# EAGLE design Cornverter (EAGLE 9.2.2)

## Sheet 1 of 7: MCU, Crystal and ICSP
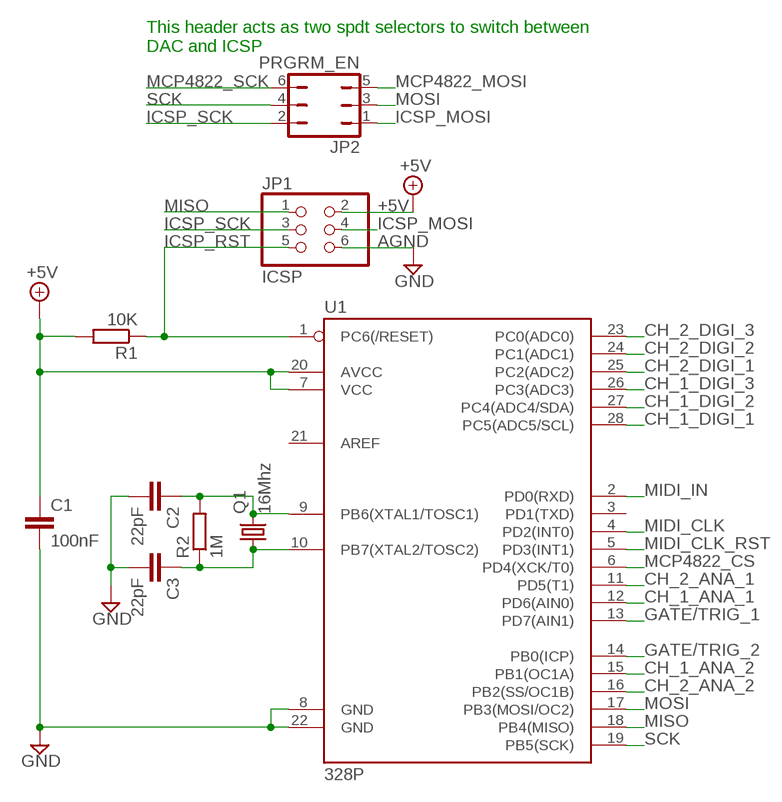
[diagram p0: schematic, sheet 1]

### Parts
C1  100nF  C-EUC1206  [C1206]
C2  22pF  C-EUC1206  [C1206]
C3  22pF  C-EUC1206  [C1206]
JP1  ICSP  PINHD-2X3  [2X03]
JP2  PRGRM_EN  JP3Q  [JP3Q]
Q1  16Mhz  CRYSTALHC49S  [HC49/S]
R1  10K  R-EU_R1206  [R1206]
R2  1M  R-EU_R1206  [R1206]
U1  328P  ATMEGA328P_PDIP  [DIP28]

### Nets
+5V: C1.1 JP1.2 R1.2 U1.7(VCC) U1.20(AVCC) ; also sheet 2,3,4,5,6,7
AGND: C1.2 C2.2 C3.2 JP1.6 U1.8(GND) U1.22(GND) ; supply symbol labelled GND ; also sheet 2,3,4,5,6,7
CH_1_ANA_1: U1.12(PD6(AIN0)) ; also sheet 5
CH_1_ANA_2: U1.15(PB1(OC1A)) ; also sheet 5
CH_1_DIGI_1: U1.28(PC5(ADC5/SCL)) ; also sheet 7
CH_1_DIGI_2: U1.27(PC4(ADC4/SDA)) ; also sheet 7
CH_1_DIGI_3: U1.26(PC3(ADC3)) ; also sheet 7
CH_2_ANA_1: U1.11(PD5(T1)) ; also sheet 5
CH_2_ANA_2: U1.16(PB2(SS/OC1B)) ; also sheet 5
CH_2_DIGI_1: U1.25(PC2(ADC2)) ; also sheet 7
CH_2_DIGI_2: U1.24(PC1(ADC1)) ; also sheet 7
CH_2_DIGI_3: U1.23(PC0(ADC0)) ; also sheet 7
GATE/TRIG_1: U1.13(PD7(AIN1)) ; also sheet 6
GATE/TRIG_2: U1.14(PB0(ICP)) ; also sheet 6
ICSP_MOSI: JP1.4 JP2.1
ICSP_RST: JP1.5 R1.1 U1.1(PC6(/RESET))
ICSP_SCK: JP1.3 JP2.2
MCP4822_CS: U1.6(PD4(XCK/T0)) ; also sheet 4
MCP4822_MOSI: JP2.5 ; also sheet 4
MCP4822_SCK: JP2.6 ; also sheet 4
MIDI_CLK: U1.4(PD2(INT0)) ; also sheet 6
MIDI_CLK_RST: U1.5(PD3(INT1)) ; also sheet 6
MIDI_IN: U1.2(PD0(RXD)) ; also sheet 3
MISO: JP1.1 U1.18(PB4(MISO))
MOSI: JP2.3 U1.17(PB3(MOSI/OC2))
N$3: C3.1 Q1.1 R2.1 U1.10(PB7(XTAL2/TOSC2))
N$4: C2.1 Q1.2 R2.2 U1.9(PB6(XTAL1/TOSC1))
SCK: JP2.4 U1.19(PB5(SCK))
Unconnected: U1.3(PD1(TXD)) U1.21(AREF)

### Notes on the sheet
- This header acts as two spdt selectors to switch between
  DAC and ICSP

## Sheet 2 of 7: Power
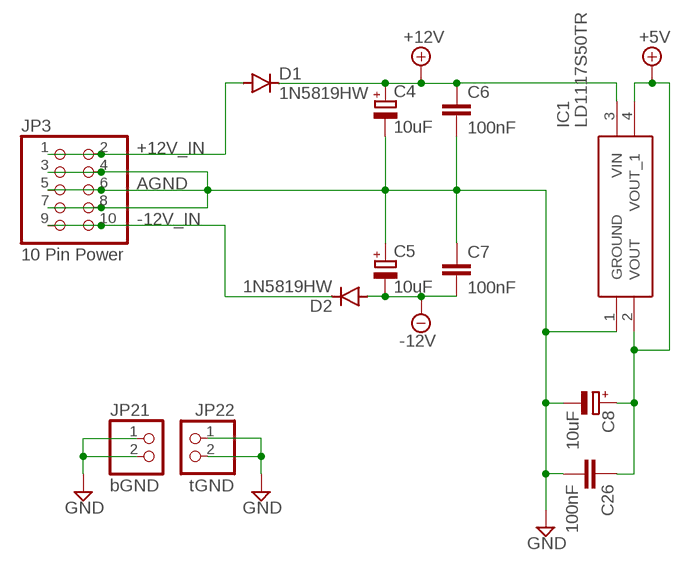
[diagram p1: schematic, sheet 2]

### Parts
C4  10uF  CPOL-EUE2-5  [E2-5]
C5  10uF  CPOL-EUE2-5  [E2-5]
C6  100nF  C-EUC1206  [C1206]
C7  100nF  C-EUC1206  [C1206]
C8  10uF  CPOL-EUE2-5  [E2-5]
C26  100nF  C-EUC1206  [C1206]
D1  1N5819HW  DIODE-SOD123  [SOD123]
D2  1N5819HW  DIODE-SOD123  [SOD123]
IC1  LD1117S50TR  [SOT230P700X190-4N]
JP3  10 Pin Power  PINHD-2X5  [2X05]
JP21  bGND  PINHD-1X2  [1X02]
JP22  tGND  PINHD-1X2  [1X02]

### Nets
+5V: C8.+ C26.1 IC1.2(VOUT) IC1.4(VOUT_1) ; also sheet 1,3,4,5,6,7
+12V: C4.+ C6.1 D1.C IC1.3(VIN) ; also sheet 4,5
+12V_IN: D1.A JP3.1 JP3.2
-12V: C5.- C7.2 D2.A ; also sheet 4,5
-12V_IN: D2.C JP3.9 JP3.10
AGND: C4.- C5.+ C6.2 C7.1 C8.- C26.2 IC1.1(GROUND) JP3.3 JP3.4 JP3.5 JP3.6 JP3.7 JP3.8 JP21.1 JP21.2 JP22.1 JP22.2 ; supply symbol labelled GND ; also sheet 1,3,4,5,6,7

## Sheet 3 of 7: MIDI Input
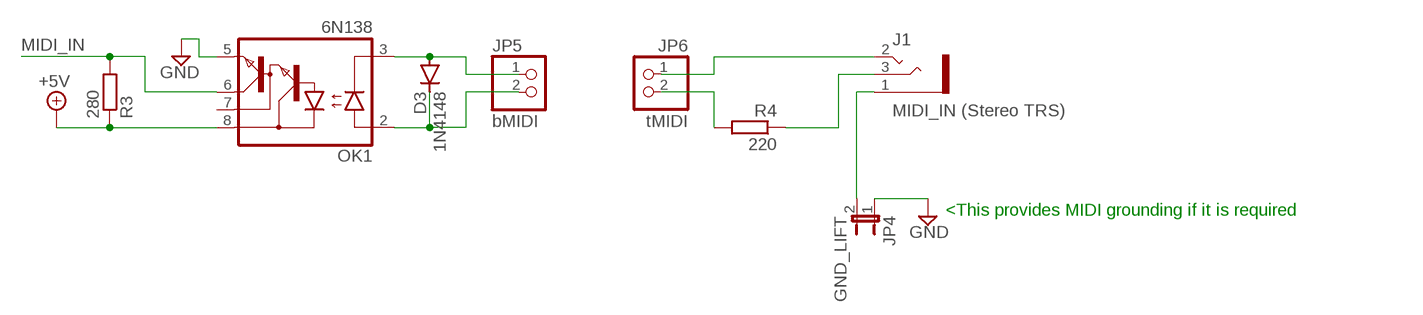
[diagram p2: schematic, sheet 3]

### Parts
D3  1N4148  1N4148DO35-7  [DO35-7]
J1  MIDI_IN (Stereo TRS)  WQP-PJ301M-12-ST_JACK  [WQP-PJ301M-12-ST_JACK]
JP4  GND_LIFT  JP1E  [JP1]
JP5  bMIDI  PINHD-1X2  [1X02]
JP6  tMIDI  PINHD-1X2  [1X02]
OK1  6N138  [DIL08]
R3  280  R-EU_R1206  [R1206]
R4  220  R-EU_R1206  [R1206]

### Nets
+5V: OK1.8(VCC) R3.1 ; also sheet 1,2,4,5,6,7
AGND: JP4.1 OK1.5(GND) ; supply symbol labelled GND ; also sheet 1,2,4,5,6,7
MIDI_IN: OK1.6(VO) R3.2 ; also sheet 1
N$1: J1.1 JP4.2
N$6: J1.3 R4.1
N$13: D3.A JP5.1 OK1.3(C)
N$17: D3.C JP5.2 OK1.2(A)
N$80: JP6.2 R4.2
N$81: J1.2 JP6.1
Unconnected: OK1.7(VB)

### Notes on the sheet
- <This provides MIDI grounding if it is required

## Sheet 4 of 7: V/Oct Outputs
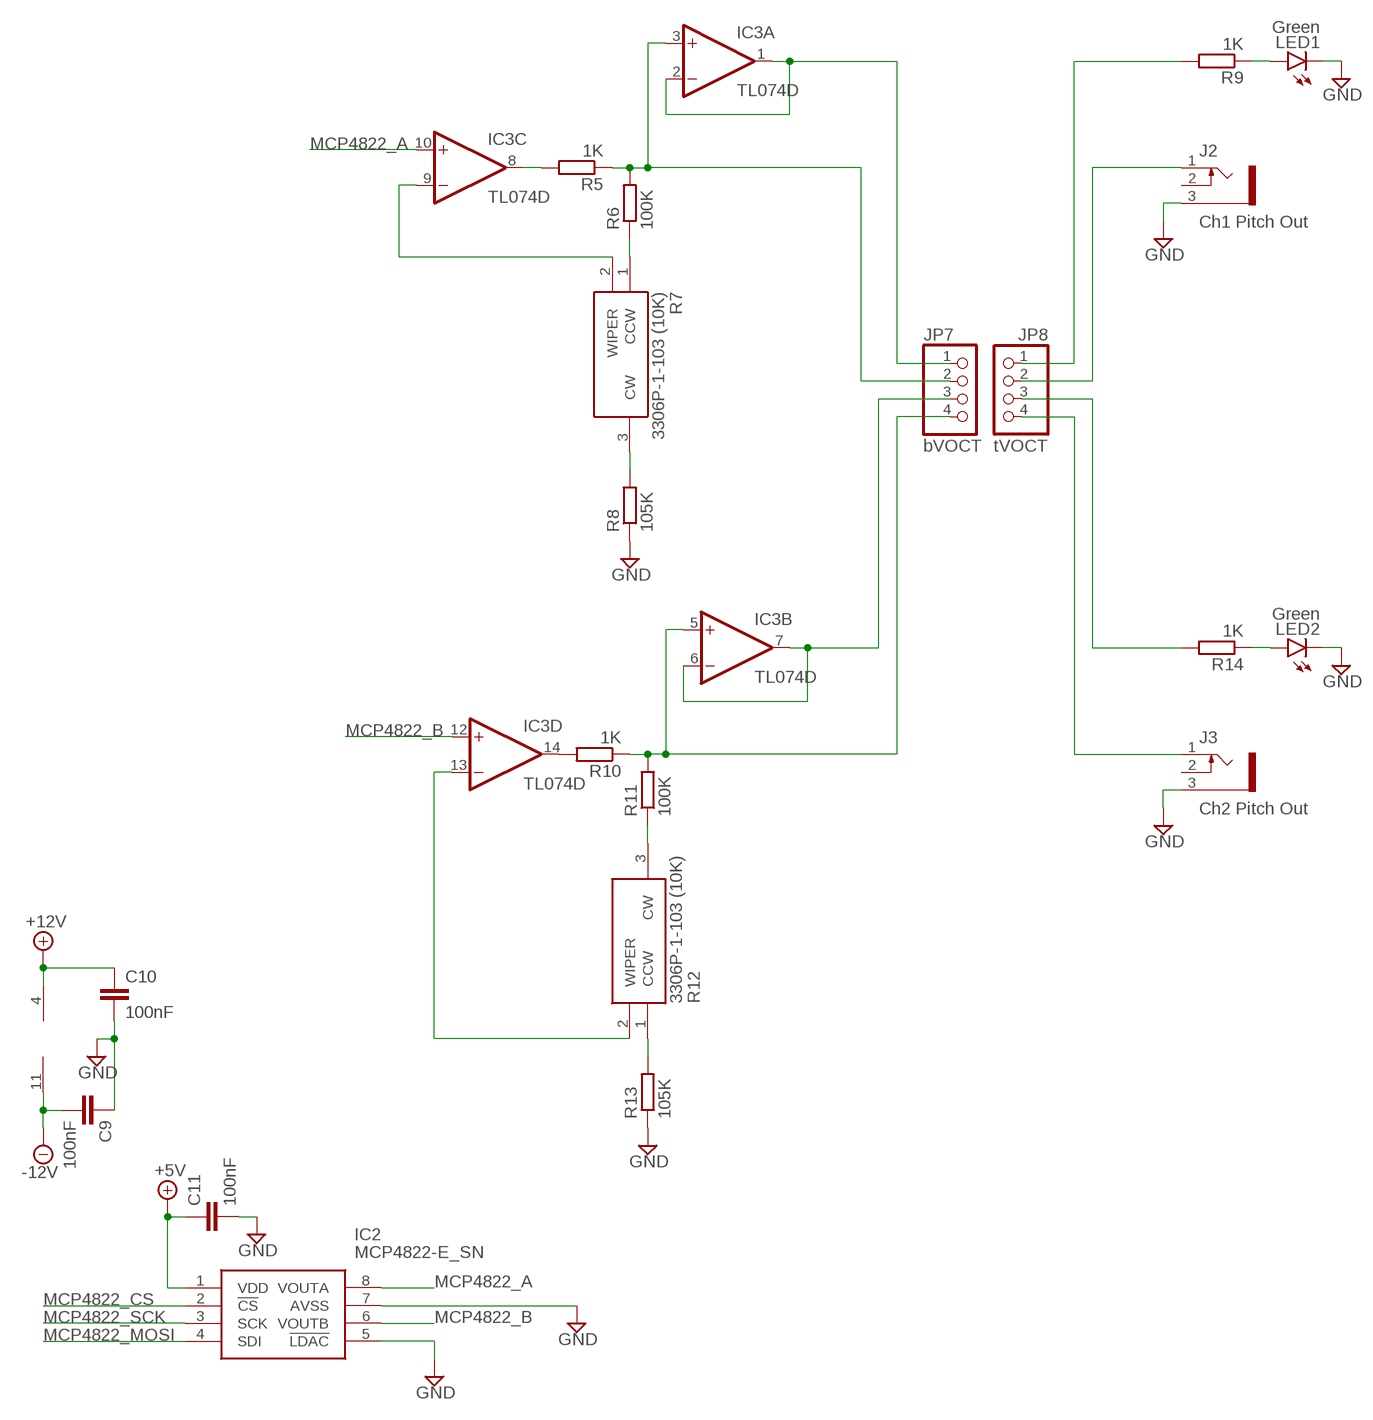
[diagram p3: schematic, sheet 4]

### Parts
C9  100nF  C-EUC1206  [C1206]
C10  100nF  C-EUC1206  [C1206]
C11  100nF  C-EUC1206  [C1206]
IC2  MCP4822-E_SN  [SOIC127P600X175-8N]
IC3  TL074D  [SO14]
J2  Ch1 Pitch Out  WQP-PJ301M-12_JACK  [WQP-PJ301M-12_JACK]
J3  Ch2 Pitch Out  WQP-PJ301M-12_JACK  [WQP-PJ301M-12_JACK]
JP7  bVOCT  PINHD-1X4  [1X04]
JP8  tVOCT  PINHD-1X4  [1X04]
LED1  Green  LED3MM  [LED3MM]
LED2  Green  LED3MM  [LED3MM]
R5  1K  R-EU_R1206  [R1206]
R6  100K  R-EU_R1206  [R1206]
R7  3306P-1-103 (10K)  3306P-1-103  [3306P1103]
R8  105K  R-EU_R1206  [R1206]
R9  1K  R-EU_R1206  [R1206]
R10  1K  R-EU_R1206  [R1206]
R11  100K  R-EU_R1206  [R1206]
R12  3306P-1-103 (10K)  3306P-1-103  [3306P1103]
R13  105K  R-EU_R1206  [R1206]
R14  1K  R-EU_R1206  [R1206]

### Nets
+5V: C11.1 IC2.1(VDD) ; also sheet 1,2,3,5,6,7
+12V: C10.1 IC3.4(P:V+) ; also sheet 2,5
-12V: C9.2 IC3.11(P:V-) ; also sheet 2,5
AGND: C9.1 C10.2 C11.2 IC2.5(!LDAC) IC2.7(AVSS) J2.3 J3.3 LED1.C LED2.C R8.1 R13.1 ; supply symbol labelled GND ; also sheet 1,2,3,5,6,7
MCP4822_A: IC2.8(VOUTA) IC3.10(C:+IN)
MCP4822_B: IC2.6(VOUTB) IC3.12(D:+IN)
MCP4822_CS: IC2.2(!CS) ; also sheet 1
MCP4822_MOSI: IC2.4(SDI) ; also sheet 1
MCP4822_SCK: IC2.3(SCK) ; also sheet 1
N$16: R6.1 R7.1(CCW)
N$19: R7.3(CW) R8.2
N$20: R12.1(CCW) R13.2
N$21: R11.1 R12.3(CW)
N$22: LED1.A R9.1
N$23: IC3.1(A:OUT) IC3.2(A:-IN) JP7.1
N$25: LED2.A R14.1
N$26: IC3.6(B:-IN) IC3.7(B:OUT) JP7.3
N$28: IC3.9(C:-IN) R7.2(WIPER)
N$29: IC3.3(A:+IN) JP7.2 R5.1 R6.2
N$33: IC3.13(D:-IN) R12.2(WIPER)
N$37: IC3.5(B:+IN) JP7.4 R10.1 R11.2
N$74: IC3.14(D:OUT) R10.2
N$75: IC3.8(C:OUT) R5.2
N$79: JP8.1 R9.2
N$84: J2.1 JP8.2
N$85: JP8.3 R14.2
N$86: J3.1 JP8.4
Unconnected: J2.2 J3.2

## Sheet 5 of 7: PWM Outputs
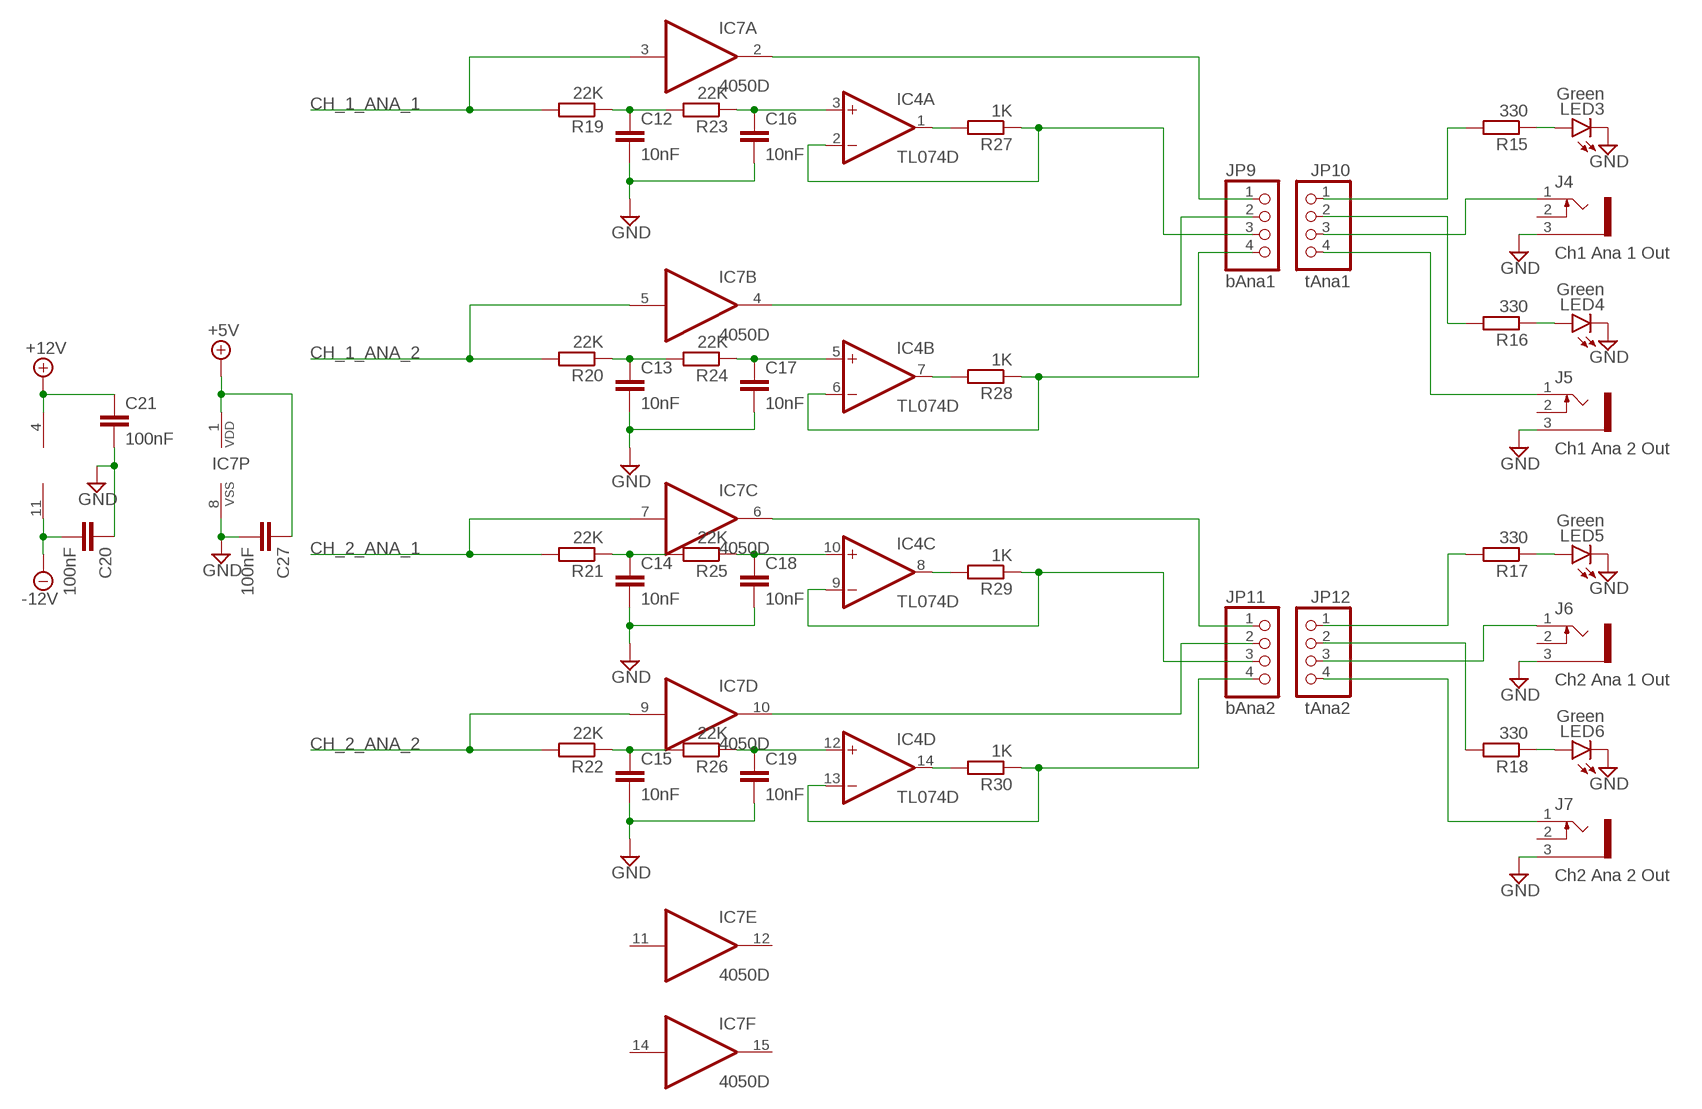
[diagram p4: schematic, sheet 5]

### Parts
C12  10nF  C-EUC1206  [C1206]
C13  10nF  C-EUC1206  [C1206]
C14  10nF  C-EUC1206  [C1206]
C15  10nF  C-EUC1206  [C1206]
C16  10nF  C-EUC1206  [C1206]
C17  10nF  C-EUC1206  [C1206]
C18  10nF  C-EUC1206  [C1206]
C19  10nF  C-EUC1206  [C1206]
C20  100nF  C-EUC1206  [C1206]
C21  100nF  C-EUC1206  [C1206]
C27  100nF  C-EUC1206  [C1206]
IC4  TL074D  [SO14]
IC7  4050D  [SO16]
J4  Ch1 Ana 1 Out  WQP-PJ301M-12_JACK  [WQP-PJ301M-12_JACK]
J5  Ch1 Ana 2 Out  WQP-PJ301M-12_JACK  [WQP-PJ301M-12_JACK]
J6  Ch2 Ana 1 Out  WQP-PJ301M-12_JACK  [WQP-PJ301M-12_JACK]
J7  Ch2 Ana 2 Out  WQP-PJ301M-12_JACK  [WQP-PJ301M-12_JACK]
JP9  bAna1  PINHD-1X4  [1X04]
JP10  tAna1  PINHD-1X4  [1X04]
JP11  bAna2  PINHD-1X4  [1X04]
JP12  tAna2  PINHD-1X4  [1X04]
LED3  Green  LED3MM  [LED3MM]
LED4  Green  LED3MM  [LED3MM]
LED5  Green  LED3MM  [LED3MM]
LED6  Green  LED3MM  [LED3MM]
R15  330  R-EU_R1206  [R1206]
R16  330  R-EU_R1206  [R1206]
R17  330  R-EU_R1206  [R1206]
R18  330  R-EU_R1206  [R1206]
R19  22K  R-EU_R1206  [R1206]
R20  22K  R-EU_R1206  [R1206]
R21  22K  R-EU_R1206  [R1206]
R22  22K  R-EU_R1206  [R1206]
R23  22K  R-EU_R1206  [R1206]
R24  22K  R-EU_R1206  [R1206]
R25  22K  R-EU_R1206  [R1206]
R26  22K  R-EU_R1206  [R1206]
R27  1K  R-EU_R1206  [R1206]
R28  1K  R-EU_R1206  [R1206]
R29  1K  R-EU_R1206  [R1206]
R30  1K  R-EU_R1206  [R1206]

### Nets
+5V: C27.1 IC7.1(P:VDD) ; also sheet 1,2,3,4,6,7
+12V: C21.1 IC4.4(P:V+) ; also sheet 2,4
-12V: C20.2 IC4.11(P:V-) ; also sheet 2,4
AGND: C12.2 C13.2 C14.2 C15.2 C16.2 C17.2 C18.2 C19.2 C20.1 C21.2 C27.2 IC7.8(P:VSS) J4.3 J5.3 J6.3 J7.3 LED3.C LED4.C LED5.C LED6.C ; supply symbol labelled GND ; also sheet 1,2,3,4,6,7
CH_1_ANA_1: IC7.3(A:I) R19.2 ; also sheet 1
CH_1_ANA_2: IC7.5(B:I) R20.2 ; also sheet 1
CH_2_ANA_1: IC7.7(C:I) R21.2 ; also sheet 1
CH_2_ANA_2: IC7.9(D:I) R22.2 ; also sheet 1
N$41: C13.1 R20.1 R24.2
N$50: LED4.A R16.1
N$56: IC4.6(B:-IN) JP9.4 R28.1
N$57: C12.1 R19.1 R23.2
N$59: LED3.A R15.1
N$60: IC4.7(B:OUT) R28.2
N$61: C17.1 IC4.5(B:+IN) R24.1
N$62: IC4.1(A:OUT) R27.2
N$63: C14.1 R21.1 R25.2
N$64: LED5.A R17.1
N$65: IC4.9(C:-IN) JP11.3 R29.1
N$67: IC4.8(C:OUT) R29.2
N$69: C16.1 IC4.3(A:+IN) R23.1
N$70: C18.1 IC4.10(C:+IN) R25.1
N$71: C15.1 R22.1 R26.2
N$72: LED6.A R18.1
N$73: IC4.13(D:-IN) JP11.4 R30.1
N$76: IC4.14(D:OUT) R30.2
N$77: IC4.2(A:-IN) JP9.3 R27.1
N$78: C19.1 IC4.12(D:+IN) R26.1
N$87: JP10.1 R15.2
N$88: J4.1 JP10.3
N$90: J5.1 JP10.4
N$91: JP12.1 R17.2
N$92: JP12.2 R18.2
N$93: J6.1 JP12.3
N$94: J7.1 JP12.4
N$115: JP10.2 R16.2
N$119: IC7.2(A:O) JP9.1
N$120: IC7.4(B:O) JP9.2
N$121: IC7.6(C:O) JP11.1
N$122: IC7.10(D:O) JP11.2
Unconnected: IC7.11(E:I) IC7.12(E:O) IC7.14(F:I) IC7.15(F:O) J4.2 J5.2 J6.2 J7.2

## Sheet 6 of 7: Gate/Trig/Clock
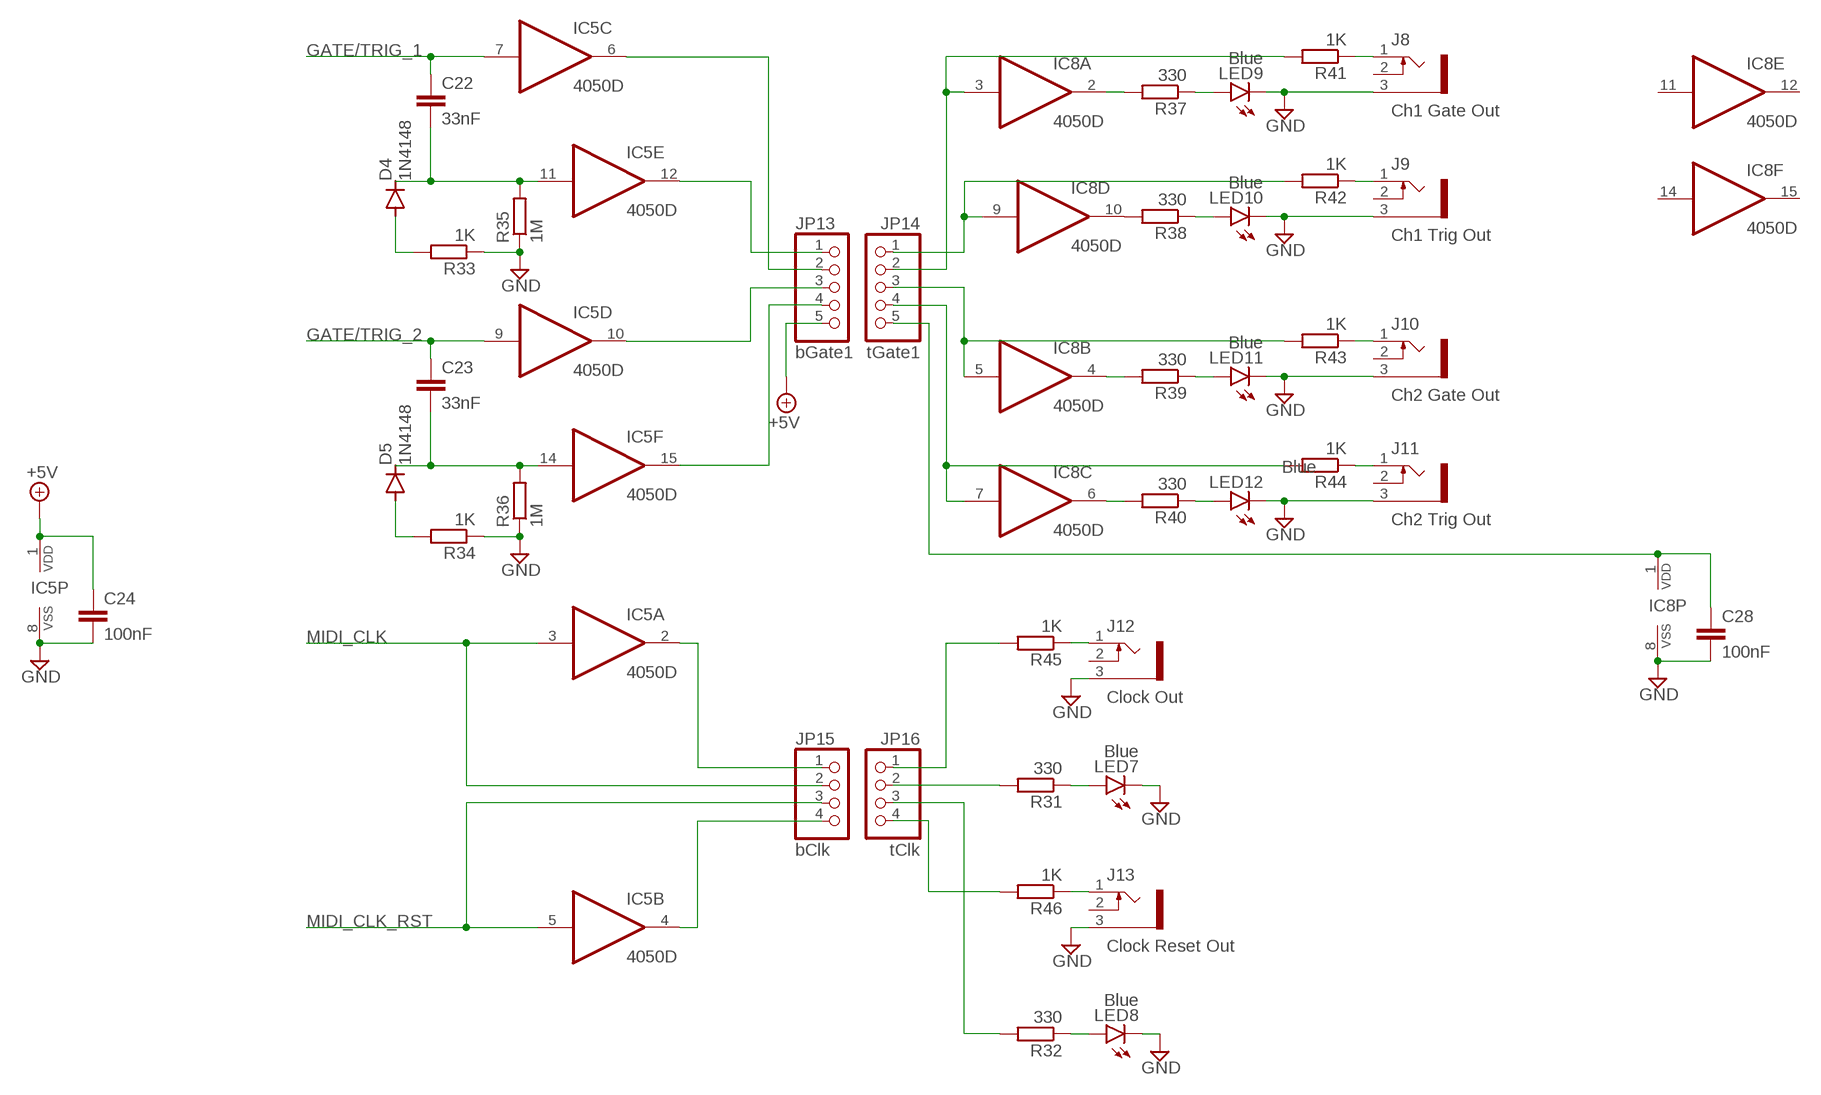
[diagram p5: schematic, sheet 6]

### Parts
C22  33nF  C-EUC1206  [C1206]
C23  33nF  C-EUC1206  [C1206]
C24  100nF  C-EUC1206  [C1206]
C28  100nF  C-EUC1206  [C1206]
D4  1N4148  1N4148DO35-7  [DO35-7]
D5  1N4148  1N4148DO35-7  [DO35-7]
IC5  4050D  [SO16]
IC8  4050D  [SO16]
J8  Ch1 Gate Out  WQP-PJ301M-12_JACK  [WQP-PJ301M-12_JACK]
J9  Ch1 Trig Out  WQP-PJ301M-12_JACK  [WQP-PJ301M-12_JACK]
J10  Ch2 Gate Out  WQP-PJ301M-12_JACK  [WQP-PJ301M-12_JACK]
J11  Ch2 Trig Out  WQP-PJ301M-12_JACK  [WQP-PJ301M-12_JACK]
J12  Clock Out  WQP-PJ301M-12_JACK  [WQP-PJ301M-12_JACK]
J13  Clock Reset Out  WQP-PJ301M-12_JACK  [WQP-PJ301M-12_JACK]
JP13  bGate1  PINHD-1X5  [1X05]
JP14  tGate1  PINHD-1X5  [1X05]
JP15  bClk  PINHD-1X4  [1X04]
JP16  tClk  PINHD-1X4  [1X04]
LED7  Blue  LED3MM  [LED3MM]
LED8  Blue  LED3MM  [LED3MM]
LED9  Blue  LED3MM  [LED3MM]
LED10  Blue  LED3MM  [LED3MM]
LED11  Blue  LED3MM  [LED3MM]
LED12  Blue  LED3MM  [LED3MM]
R31  330  R-EU_R1206  [R1206]
R32  330  R-EU_R1206  [R1206]
R33  1K  R-EU_R1206  [R1206]
R34  1K  R-EU_R1206  [R1206]
R35  1M  R-EU_R1206  [R1206]
R36  1M  R-EU_R1206  [R1206]
R37  330  R-EU_R1206  [R1206]
R38  330  R-EU_R1206  [R1206]
R39  330  R-EU_R1206  [R1206]
R40  330  R-EU_R1206  [R1206]
R41  1K  R-EU_R1206  [R1206]
R42  1K  R-EU_R1206  [R1206]
R43  1K  R-EU_R1206  [R1206]
R44  1K  R-EU_R1206  [R1206]
R45  1K  R-EU_R1206  [R1206]
R46  1K  R-EU_R1206  [R1206]

### Nets
+5V: C24.1 IC5.1(P:VDD) JP13.5 ; also sheet 1,2,3,4,5,7
AGND: C24.2 C28.2 IC5.8(P:VSS) IC8.8(P:VSS) J8.3 J9.3 J10.3 J11.3 J12.3 J13.3 LED7.C LED8.C LED9.C LED10.C LED11.C LED12.C R33.1 R34.1 R35.1 R36.1 ; supply symbol labelled GND ; also sheet 1,2,3,4,5,7
GATE/TRIG_1: C22.1 IC5.7(C:I) ; also sheet 1
GATE/TRIG_2: C23.1 IC5.9(D:I) ; also sheet 1
MIDI_CLK: IC5.3(A:I) JP15.2 ; also sheet 1
MIDI_CLK_RST: IC5.5(B:I) JP15.3 ; also sheet 1
N$24: C22.2 D4.C IC5.11(E:I) R35.2
N$27: D4.A R33.2
N$30: IC8.7(C:I) JP14.4 R44.2
N$31: LED12.A R40.1
N$32: LED11.A R39.1
N$34: IC8.5(B:I) JP14.3 R43.2
N$35: J11.1 R44.1
N$36: J10.1 R43.1
N$38: C23.2 D5.C IC5.14(F:I) R36.2
N$39: D5.A R34.2
N$40: IC8.9(D:I) JP14.1 R42.2
N$42: LED10.A R38.1
N$43: LED9.A R37.1
N$44: IC8.3(A:I) JP14.2 R41.2
N$45: LED7.A R31.1
N$46: J12.1 R45.1
N$47: IC5.2(A:O) JP15.1
N$48: J13.1 R46.1
N$49: IC5.4(B:O) JP15.4
N$51: LED8.A R32.1
N$82: J9.1 R42.1
N$83: J8.1 R41.1
N$89: IC8.2(A:O) R37.2
N$95: IC5.6(C:O) JP13.2
N$96: IC5.12(E:O) JP13.1
N$97: IC5.15(F:O) JP13.4
N$98: IC5.10(D:O) JP13.3
N$100: JP16.1 R45.2
N$101: JP16.2 R31.2
N$102: JP16.4 R46.2
N$103: JP16.3 R32.2
N$116: IC8.10(D:O) R38.2
N$117: IC8.4(B:O) R39.2
N$118: IC8.6(C:O) R40.2
TOP+5V: C28.1 IC8.1(P:VDD) JP14.5
Unconnected: IC8.11(E:I) IC8.12(E:O) IC8.14(F:I) IC8.15(F:O) J8.2 J9.2 J10.2 J11.2 J12.2 J13.2

## Sheet 7 of 7: General Digital Outs
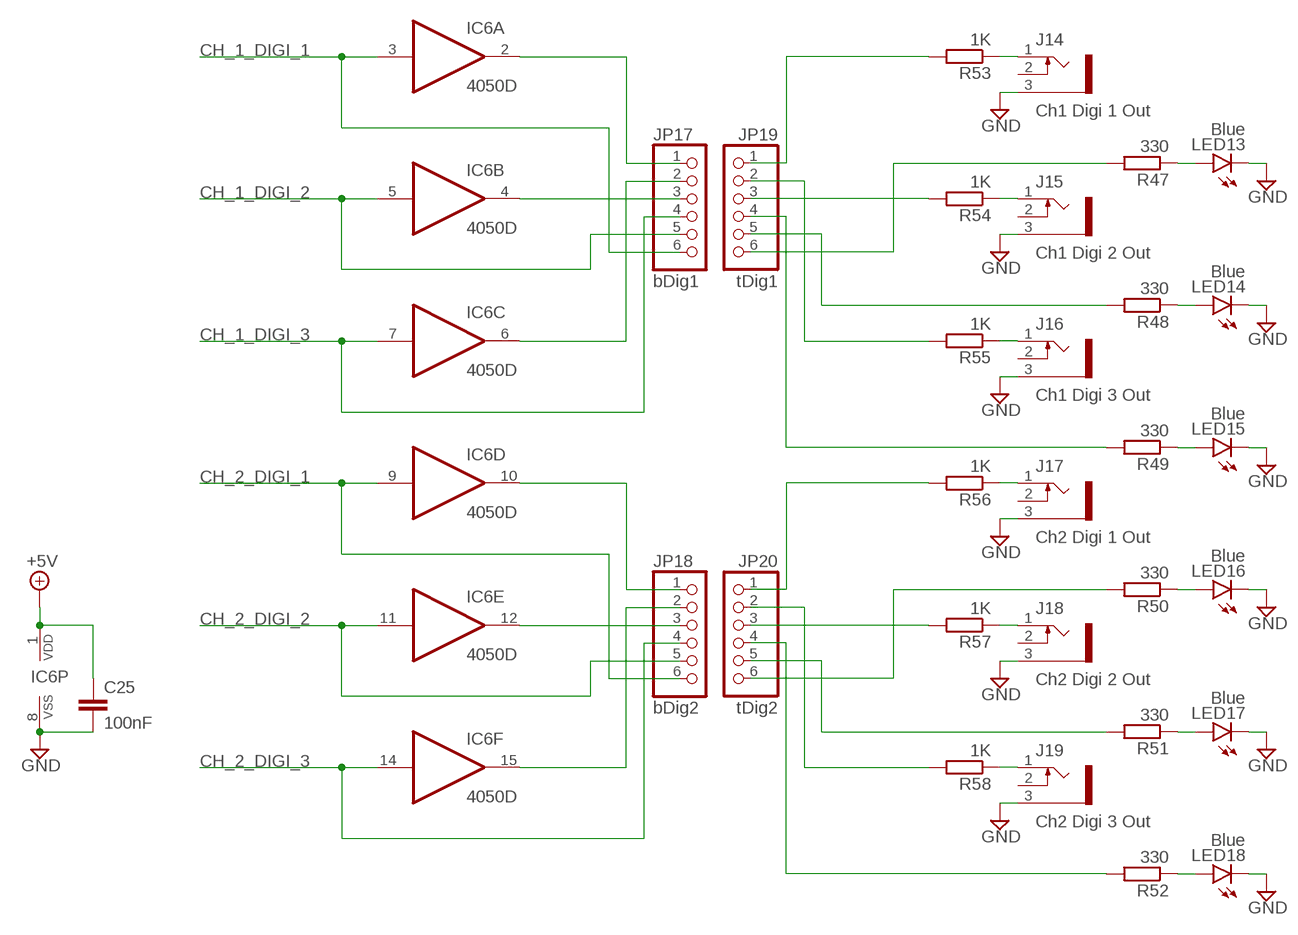
[diagram p6: schematic, sheet 7]

### Parts
C25  100nF  C-EUC1206  [C1206]
IC6  4050D  [SO16]
J14  Ch1 Digi 1 Out  WQP-PJ301M-12_JACK  [WQP-PJ301M-12_JACK]
J15  Ch1 Digi 2 Out  WQP-PJ301M-12_JACK  [WQP-PJ301M-12_JACK]
J16  Ch1 Digi 3 Out  WQP-PJ301M-12_JACK  [WQP-PJ301M-12_JACK]
J17  Ch2 Digi 1 Out  WQP-PJ301M-12_JACK  [WQP-PJ301M-12_JACK]
J18  Ch2 Digi 2 Out  WQP-PJ301M-12_JACK  [WQP-PJ301M-12_JACK]
J19  Ch2 Digi 3 Out  WQP-PJ301M-12_JACK  [WQP-PJ301M-12_JACK]
JP17  bDig1  PINHD-1X6  [1X06]
JP18  bDig2  PINHD-1X6  [1X06]
JP19  tDig1  PINHD-1X6  [1X06]
JP20  tDig2  PINHD-1X6  [1X06]
LED13  Blue  LED3MM  [LED3MM]
LED14  Blue  LED3MM  [LED3MM]
LED15  Blue  LED3MM  [LED3MM]
LED16  Blue  LED3MM  [LED3MM]
LED17  Blue  LED3MM  [LED3MM]
LED18  Blue  LED3MM  [LED3MM]
R47  330  R-EU_R1206  [R1206]
R48  330  R-EU_R1206  [R1206]
R49  330  R-EU_R1206  [R1206]
R50  330  R-EU_R1206  [R1206]
R51  330  R-EU_R1206  [R1206]
R52  330  R-EU_R1206  [R1206]
R53  1K  R-EU_R1206  [R1206]
R54  1K  R-EU_R1206  [R1206]
R55  1K  R-EU_R1206  [R1206]
R56  1K  R-EU_R1206  [R1206]
R57  1K  R-EU_R1206  [R1206]
R58  1K  R-EU_R1206  [R1206]

### Nets
+5V: C25.1 IC6.1(P:VDD) ; also sheet 1,2,3,4,5,6
AGND: C25.2 IC6.8(P:VSS) J14.3 J15.3 J16.3 J17.3 J18.3 J19.3 LED13.C LED14.C LED15.C LED16.C LED17.C LED18.C ; supply symbol labelled GND ; also sheet 1,2,3,4,5,6
CH_1_DIGI_1: IC6.3(A:I) JP17.6 ; also sheet 1
CH_1_DIGI_2: IC6.5(B:I) JP17.5 ; also sheet 1
CH_1_DIGI_3: IC6.7(C:I) JP17.4 ; also sheet 1
CH_2_DIGI_1: IC6.9(D:I) JP18.6 ; also sheet 1
CH_2_DIGI_2: IC6.11(E:I) JP18.5 ; also sheet 1
CH_2_DIGI_3: IC6.14(F:I) JP18.4 ; also sheet 1
N$2: LED15.A R49.1
N$5: J16.1 R55.1
N$7: JP19.1 R53.2
N$8: J17.1 R56.1
N$9: JP19.6 R47.2
N$10: LED16.A R50.1
N$11: LED17.A R51.1
N$12: J18.1 R57.1
N$14: JP19.3 R54.2
N$15: J19.1 R58.1
N$18: JP19.4 R49.2
N$52: LED13.A R47.1
N$53: J14.1 R53.1
N$54: JP19.2 R55.2
N$55: J15.1 R54.1
N$58: JP19.5 R48.2
N$66: LED14.A R48.1
N$68: LED18.A R52.1
N$99: JP20.1 R56.2
N$104: JP20.6 R50.2
N$105: JP20.2 R58.2
N$106: JP20.5 R51.2
N$107: JP20.3 R57.2
N$108: JP20.4 R52.2
N$109: IC6.2(A:O) JP17.1
N$110: IC6.6(C:O) JP17.2
N$111: IC6.10(D:O) JP18.1
N$112: IC6.15(F:O) JP18.2
N$113: IC6.12(E:O) JP18.3
N$114: IC6.4(B:O) JP17.3
Unconnected: J14.2 J15.2 J16.2 J17.2 J18.2 J19.2

## Library data of the parts
C1-C3 C6 C7 C9-C28 = rcl:C-EU: CAPACITOR, European symbol; SPICEPREFIX: C
C4 C5 C8 = rcl:CPOL-EU: POLARIZED CAPACITOR, European symbol; SPICEPREFIX: C
D1 D2 = diode:DIODE-: DIODE
D3-D5 = diode:1N4148: DIODE high speed (Philips)
IC1 = SamacSys_Parts:LD1117S50TR: LD1117S50TR, Low Dropout Voltage Regulator, 1.3A, 5 V 1%, 4-Pin SOT-223 Source: Datasheet <https://componentsearchengine.com/Datasheets/1/LD1117S50TR.pdf>; DESCRIPTION: LD1117S50TR, Low Dropout Voltage Regulator, 1.3A, 5 V 1%, 4-Pin SOT-223; HEIGHT: 1.9mm; MANUFACTURER_NAME: STMicroelectronics; MANUFACTURER_PART_NUMBER: LD1117S50TR; MOUSER_PART_NUMBER: 511-LD1117S50
IC2 = SamacSys_Parts:MCP4822-E_SN: D/A Converter 12-Bit 2ch SPI SOIC8 Source: Datasheet <https://componentsearchengine.com/Datasheets/1/MCP4822-E_SN.pdf>; DESCRIPTION: D/A Converter 12-Bit 2ch SPI SOIC8; HEIGHT: 1.75mm; MANUFACTURER_NAME: Microchip; MANUFACTURER_PART_NUMBER: MCP4822-E/SN; MOUSER_PART_NUMBER: 579-MCP4822-E/SN
IC3 IC4 = Improved parts:TL074: OP AMP
IC5-IC8 = 40xx:4050: Hex non-inverting BUFFER
J1 = thonkiconn:WQP-PJ301M-12-ST_JACK: Thonkiconn stereo jack
J2-J19 = thonkiconn:WQP-PJ301M-12_JACK: Thonkiconn mono jack
JP1 = pinhead:PINHD-2X3: PIN HEADER
JP2 = jumper:JP3Q: JUMPER
JP3 = pinhead:PINHD-2X5: PIN HEADER
JP4 = jumper:JP1E: JUMPER
JP5 JP6 JP21 JP22 = pinhead:PINHD-1X2: PIN HEADER
JP7-JP12 JP15 JP16 = pinhead:PINHD-1X4: PIN HEADER
JP13 JP14 = pinhead:PINHD-1X5: PIN HEADER
JP17-JP20 = pinhead:PINHD-1X6: PIN HEADER
LED1-LED18 = Improved parts:LED3MM: 3MM LED with clearer silkscreen than stock
OK1 = optocoupler:6N138: MOTOROLA OPTO COUPLER; MF: VISHAY/TELEFUNKEN; MPN: 6N138; OC_FARNELL: 9860150; OC_NEWARK: 35K5294; SPICEPREFIX: X
Q1 = crystal:CRYSTAL: CRYSTAL; OC_FARNELL: 1667008; OC_NEWARK: unknown
R1 = resistor:R-EU_: RESISTOR, European symbol
R2-R6 R8-R11 R13-R58 = rcl:R-EU_: RESISTOR, European symbol; SPICEPREFIX: R
R7 R12 = SamacSys_Parts:3306P-1-103: 3306P 1-turn cermet trimmer,10K 300mW Bourns 3306P Series Through Hole Cermet Trimmer Resistor with Pin Terminations, 10k 25% 1/5W 250ppm/C Top Adjust Source: Datasheet <https://componentsearchengine.com/Datasheets/1/3306P-1-103.pdf>; DESCRIPTION: 3306P 1-turn cermet trimmer,10K 300mW Bourns 3306P Series Through Hole Cermet Trimmer Resistor with Pin Terminations, 10k 25% 1/5W 250ppm/C Top Adjust; HEIGHT: 8mm; MANUFACTURER_NAME: Bourns; MANUFACTURER_PART_NUMBER: 3306P-1-103; MOUSER_PART_NUMBER: 652-3306P-1-103
U1 = SparkFun-IC-Microcontroller:ATMEGA328P_PDIP: Atmel 328P Through hole ATMEGA328P uC used in the Arduino 32kb flash, 1k EEPROM, 2k SRAM Datasheet <http://www.sparkfun.com/datasheets/Components/SMD/ATMega328.pdf> SparkFun Products Storefront component: AVR 28 Pin 20MHz 32K 6A/D - ATMega328P <https://www.sparkfun.com/products/9061> (COM-09061) SparkFun Simon Says - Through-Hole Soldering Kit <https://www.sparkfun.com/products/10547> (KIT-10547) SparkFun Learn to Solder - Simon Says <https://www.sparkfun.com/products/13708> (KIT-13708) SparkFun BigTime Watch Kit <https://www.sparkfun.com/products/11734> (KIT-11734) SparkFun ClockIt <https://www.sparkfun.com/products/10930> (KIT-10930) SparkFun Serial Enabled LCD Kit <https://www.sparkfun.com/products/10097> (LCD-10097) SparkFun Simon Tilts - Through Hole Soldering Kit <https://www.sparkfun.com/products/12634> (KIT-12634) SparkFun Frequency Counter Kit <https://www.sparkfun.com/products/10140> (KIT-10140) FabFM Radio Kit <https://www.sparkfun.com/products/11043> (KIT-11043) SparkFun Binary Blaster Kit <https://www.sparkfun.com/products/12037> (KIT-12037) SparkFun Metro-Gnome <https://www.sparkfun.com/products/9236> (KIT-09236) ATmega328 with Arduino Optiboot (Uno) <https://www.sparkfun.com/products/10524> (DEV-10524); PROD_ID: IC-09136

## Board
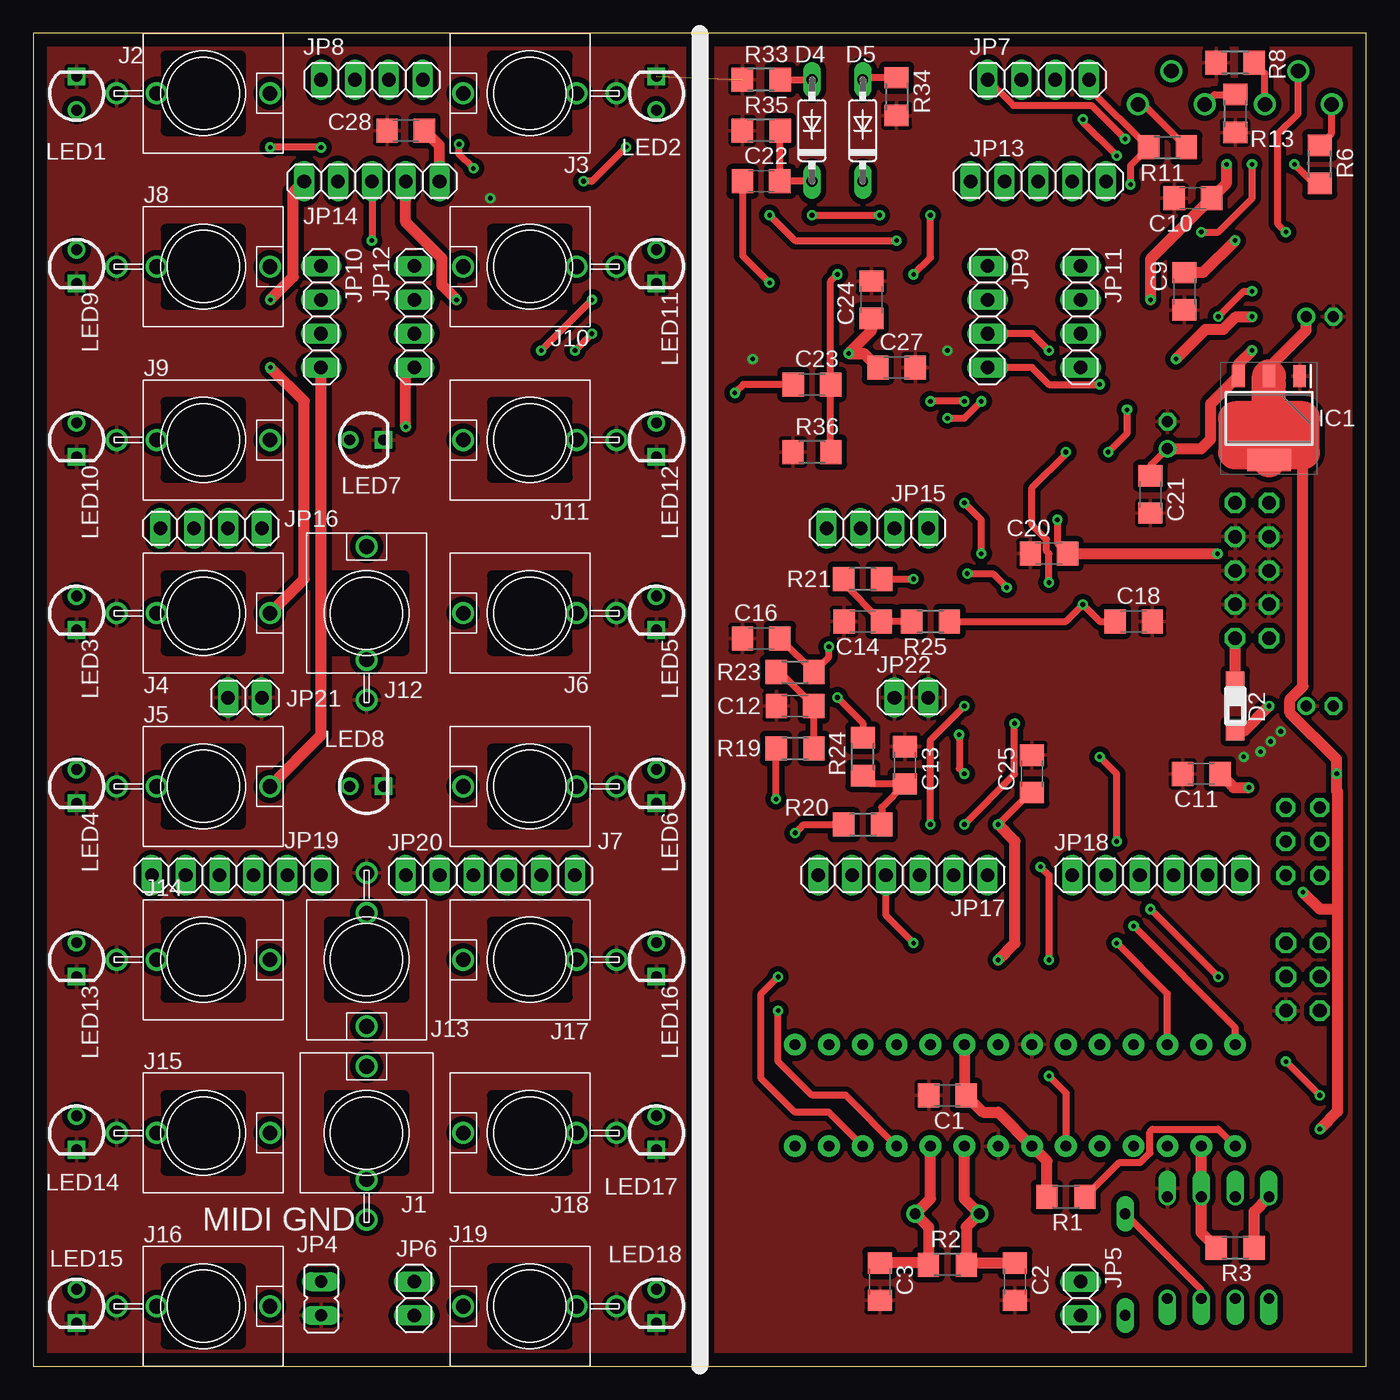
[diagram p7: board, top side]
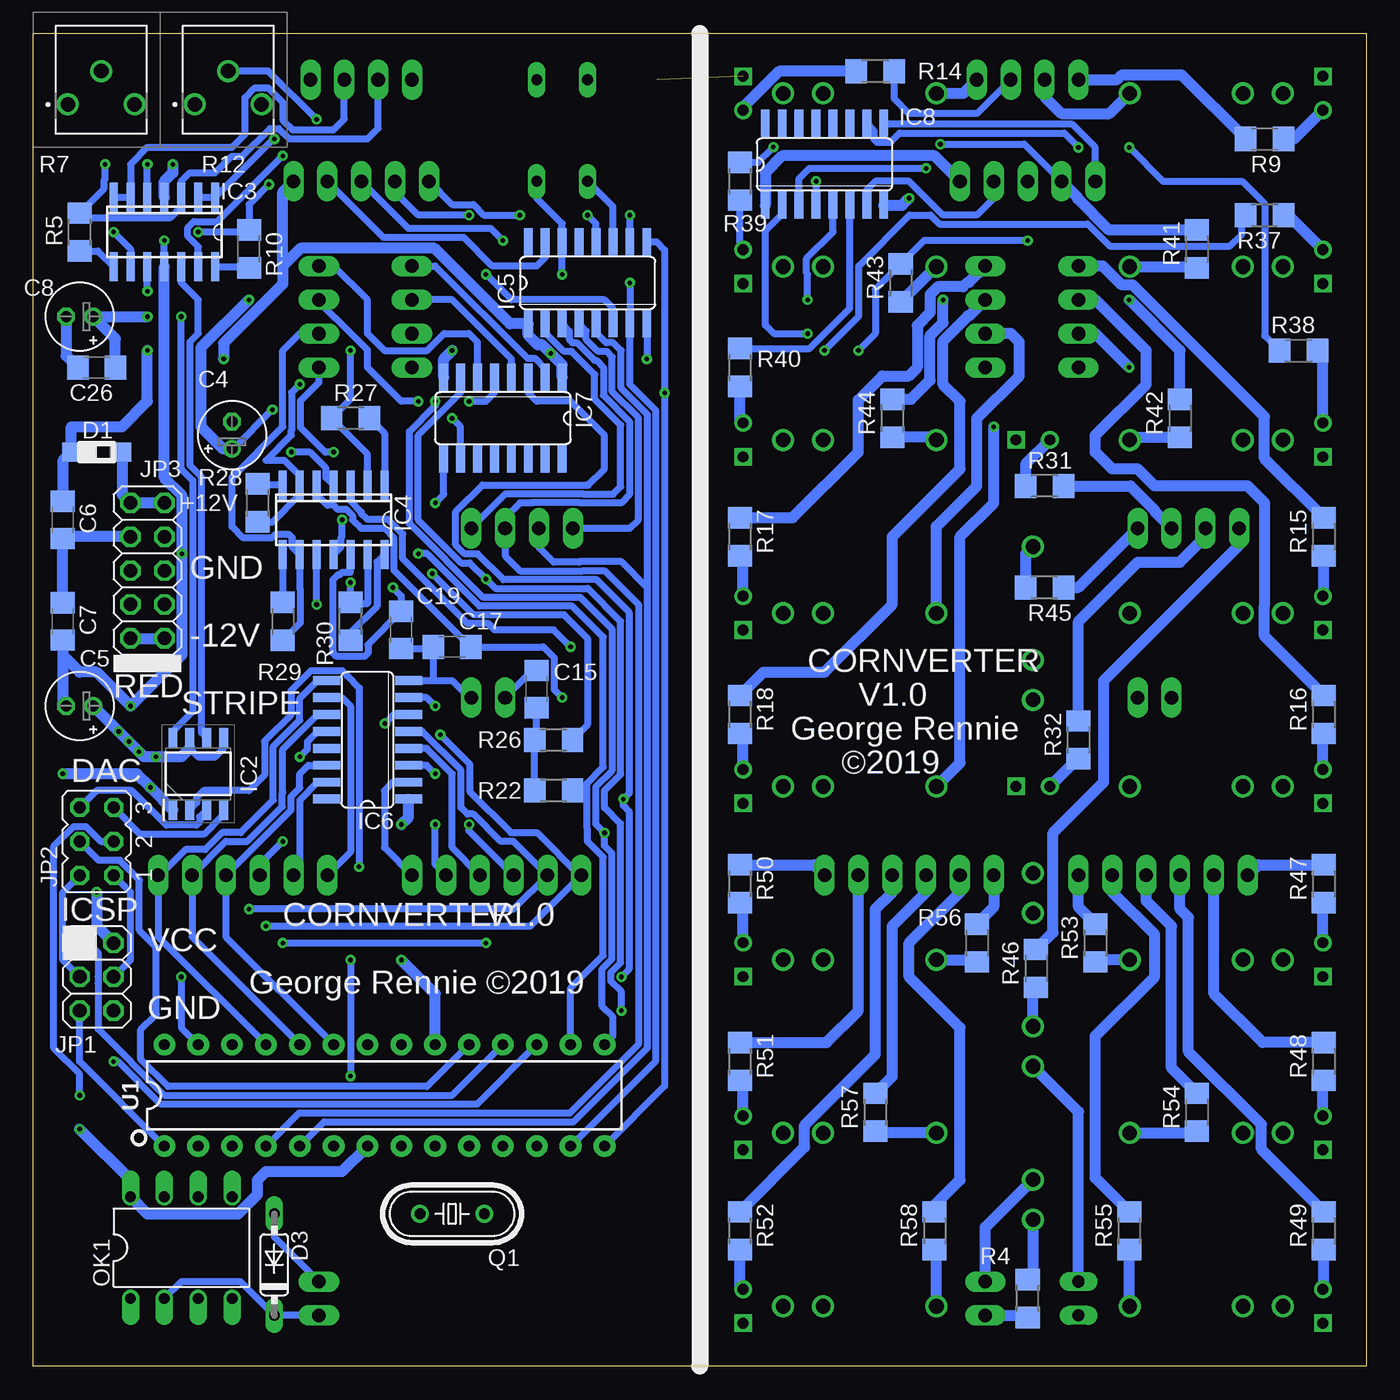
[diagram p8: board, bottom side, seen from below]

Size 100 x 100 mm. Coordinates in mm from the lower left corner, seen from the top.
Outline: 0,0 100,0 100,100 0,100 0,0
Copper layers (1*16): Top 0.035mm / dielectric 1.5mm / Bottom 0.035mm
Design rules "default *": minimum track width 6mil, minimum drill 0.35mm, track to track 6mil, track to pad 6mil, pad to pad 6mil, via to via 6mil, smd to smd 6mil, copper to edge 40mil, drill to drill 6mil, minimum pad ring 10mil, minimum via ring 8mil, stop-mask expansion 4mil, vias tented up to drill 0mil, thermal gap 10mil
tRestrict: 1 lines
bRestrict: 1 lines

### Footprints (pad centres in the part's own frame; a part is rotated, then mirrored left to right if it is on the bottom)
C1206 = smd 1.6 x 1.8: 1 -1.4,0; 2 1.4,0
E2-5 = drill 0.813 pad 1.27: + -1.016,0 | drill 0.813 pad 1.27 octagon: - 1.016,0
SOD123 = smd 1.4 x 1.4: A 1.9,0; C -1.9,0
DO35-7 = drill 0.813 long: A 3.81,0; C -3.81,0
SOT230P700X190-4N = smd 1.65 x 0.95: 1 -3.15,2.3; 2 -3.15,0; 3 -3.15,-2.3 | smd 1.65 x 3.25: 4 3.15,0
SOIC127P600X175-8N = smd 1.5 x 0.65: 1 -2.7,1.905; 2 -2.7,0.635; 3 -2.7,-0.635; 4 -2.7,-1.905; 5 2.7,-1.905; 6 2.7,-0.635; 7 2.7,0.635; 8 2.7,1.905
SO14 = smd 0.6 x 2.2: 1 -3.81,-2.6; 2 -2.54,-2.6; 3 -1.27,-2.6; 4 0,-2.6; 5 1.27,-2.6; 6 2.54,-2.6; 7 3.81,-2.6; 8 3.81,2.6; 9 2.54,2.6; 10 1.27,2.6; 11 0,2.6; 12 -1.27,2.6; 13 -2.54,2.6; 14 -3.81,2.6
SO16 = smd 0.66 x 2.032: 1 -4.445,-3.073; 2 -3.175,-3.073; 3 -1.905,-3.073; 4 -0.635,-3.073; 5 0.635,-3.073; 6 1.905,-3.073; 7 3.175,-3.073; 8 4.445,-3.073; 9 4.445,3.073; 10 3.175,3.073; 11 1.905,3.073; 12 0.635,3.073; 13 -0.635,3.073; 14 -1.905,3.073; 15 -3.175,3.073; 16 -4.445,3.073
WQP-PJ301M-12-ST_JACK = drill 1.1: 1 0,5; 2 0,-3.5; 3 0,-6.5
WQP-PJ301M-12_JACK = drill 1.1: 1 0,5; 2 0,-3.5; 3 0,-6.5
2X03 = drill 1.016 octagon: 1 -2.54,-1.27; 2 -2.54,1.27; 3 0,-1.27; 4 0,1.27; 5 2.54,-1.27; 6 2.54,1.27
JP3Q = drill 0.914 octagon: 1 -2.54,-1.27; 2 -2.54,1.27; 3 0,-1.27; 4 0,1.27; 5 2.54,-1.27; 6 2.54,1.27
2X05 = drill 1.016 octagon: 1 -5.08,-1.27; 2 -5.08,1.27; 3 -2.54,-1.27; 4 -2.54,1.27; 5 0,-1.27; 6 0,1.27; 7 2.54,-1.27; 8 2.54,1.27; 9 5.08,-1.27; 10 5.08,1.27
JP1 = drill 0.914 long: 1 0,-1.27; 2 0,1.27
1X02 = drill 1.016 long: 1 -1.27,0; 2 1.27,0
1X04 = drill 1.016 long: 1 -3.81,0; 2 -1.27,0; 3 1.27,0; 4 3.81,0
1X05 = drill 1.016 long: 1 -5.08,0; 2 -2.54,0; 3 0,0; 4 2.54,0; 5 5.08,0
1X06 = drill 1.016 long: 1 -6.35,0; 2 -3.81,0; 3 -1.27,0; 4 1.27,0; 5 3.81,0; 6 6.35,0
LED3MM = drill 0.813: A -1.27,0 | drill 0.813 square: C 1.27,0
DIL08 = drill 0.813 offset: 1 -3.81,-3.81; 2 -1.27,-3.81; 3 1.27,-3.81; 4 3.81,-3.81; 5 3.81,3.81; 6 1.27,3.81; 7 -1.27,3.81; 8 -3.81,3.81
HC49/S = drill 0.813: 1 -2.413,0; 2 2.413,0
R1206 = smd 1.6 x 1.803: 1 -1.422,0; 2 1.422,0
3306P1103 = drill 1.1 pad 1.65: 1 -2.153,-1.85; 2 0.347,0.65; 3 2.847,-1.85
DIP28 = drill 0.813 pad 1.626: 1 -16.51,-3.81; 2 -13.97,-3.81; 3 -11.43,-3.81; 4 -8.89,-3.81; 5 -6.35,-3.81; 6 -3.81,-3.81; 7 -1.27,-3.81; 8 1.27,-3.81; 9 3.81,-3.81; 10 6.35,-3.81; 11 8.89,-3.81; 12 11.43,-3.81; 13 13.97,-3.81; 14 16.51,-3.81; 15 16.51,3.81; 16 13.97,3.81; 17 11.43,3.81; 18 8.89,3.81; 19 6.35,3.81; 20 3.81,3.81; 21 1.27,3.81; 22 -1.27,3.81; 23 -3.81,3.81; 24 -6.35,3.81; 25 -8.89,3.81; 26 -11.43,3.81; 27 -13.97,3.81; 28 -16.51,3.81

### Placement (x,y rotation side)
C1  68.58,20.32 180 top
C2  73.66,6.35 270 top
C3  63.5,6.35 270 top
C4  85.09,69.85 90 bottom
C5  96.52,49.53 180 bottom
C6  97.79,63.5 270 bottom
C7  97.79,55.88 270 bottom
C8  96.52,78.74 180 bottom
C9  86.36,80.64 90 top
C10  87,87.63 180 top
C11  87.63,44.45 180 top
C12  57.15,49.53 180 top
C13  65.41,45.09 90 top
C14  62.23,55.88 180 top
C15  62.23,50.8 90 bottom
C16  54.61,54.61 180 top
C17  68.58,53.98 180 bottom
C18  82.55,55.88 0 top
C19  72.39,55.24 270 bottom
C20  76.2,60.96 0 top
C21  83.82,65.41 270 top
C22  54.61,88.9 0 top
C23  58.42,73.66 0 top
C24  62.87,80.01 90 top
C25  74.93,44.45 90 top
C26  95.25,74.93 180 bottom
C27  64.77,74.93 0 top
C28  27.94,92.71 180 top
D1  95.25,68.58 0 bottom
D2  90.17,49.53 270 top
D3  81.92,7.62 90 bottom
D4  58.42,92.71 90 top
D5  62.23,92.71 90 top
IC1  92.71,71.12 270 top
IC2  87.63,44.45 90 bottom
IC3  90.17,85.09 180 bottom
IC4  77.47,63.5 180 bottom
IC5  58.42,81.28 0 bottom
IC6  74.93,46.99 90 bottom
IC7  64.77,71.12 180 bottom
IC8  40.64,90.17 0 bottom
J1  25,17.5 0 top
J2  12.75,95.5 270 top
J3  37.25,95.5 90 top
J4  12.75,56.5 270 top
J5  12.75,43.5 270 top
J6  37.25,56.5 90 top
J7  37.25,43.5 90 top
J8  12.75,82.5 270 top
J9  12.75,69.5 270 top
J10  37.25,82.5 90 top
J11  37.25,69.5 90 top
J12  25,56.5 0 top
J13  25,30.5 180 top
J14  12.75,30.5 270 top
J15  12.75,17.5 270 top
J16  12.75,4.5 270 top
J17  37.25,30.5 90 top
J18  37.25,17.5 90 top
J19  37.25,4.5 90 top
JP1  95.25,29.21 270 bottom
JP2  95.25,39.37 90 bottom
JP3  91.44,59.69 270 bottom
JP4  21.59,5.08 0 top
JP5  78.57,5.08 270 top
JP6  28.57,5.08 270 top
JP7  75.4,96.52 0 top
JP8  25.4,96.52 0 top
JP9  71.59,78.74 270 top
JP10  21.59,78.74 270 top
JP11  78.57,78.74 270 top
JP12  28.57,78.74 270 top
JP13  75.4,88.9 0 top
JP14  25.4,88.9 0 top
JP15  63.33,62.87 180 top
JP16  13.34,62.87 180 top
JP17  65.24,36.83 180 top
JP18  84.29,36.83 0 top
JP19  15.24,36.83 180 top
JP20  34.29,36.83 0 top
JP21  15.88,50.16 0 top
JP22  65.87,50.16 0 top
LED1  3.25,95.5 90 top
LED2  46.75,95.5 90 top
LED3  3.25,56.5 270 top
LED4  3.25,43.5 270 top
LED5  46.75,56.5 270 top
LED6  46.75,43.5 270 top
LED7  25,69.5 0 top
LED8  25,43.5 0 top
LED9  3.25,82.5 270 top
LED10  3.25,69.5 270 top
LED11  46.75,82.5 270 top
LED12  46.75,69.5 270 top
LED13  3.25,30.5 270 top
LED14  3.25,17.5 270 top
LED15  3.25,4.5 270 top
LED16  46.75,30.5 270 top
LED17  46.75,17.5 270 top
LED18  46.75,4.5 270 top
OK1  88.9,8.89 0 bottom
Q1  68.58,11.43 180 bottom
R1  77.47,12.7 180 top
R2  68.58,7.62 0 top
R3  90.17,8.89 180 top
R4  25.4,5.08 270 bottom
R5  96.52,85.09 270 bottom
R6  96.52,90.17 270 top
R7  95.25,96.52 0 bottom
R8  90.17,97.79 0 top
R9  7.62,92.08 180 bottom
R10  83.82,83.82 270 bottom
R11  85.09,91.44 180 top
R12  85.72,96.52 0 bottom
R13  90.17,93.98 90 top
R14  36.83,97.16 0 bottom
R15  3.17,62.23 90 bottom
R16  3.17,48.9 90 bottom
R17  46.99,62.23 90 bottom
R18  46.99,48.9 90 bottom
R19  57.15,46.35 180 top
R20  62.23,40.64 180 top
R21  62.23,59.05 0 top
R22  60.96,43.18 0 bottom
R23  57.15,52.07 180 top
R24  62.23,45.72 270 top
R25  67.31,55.88 180 top
R26  60.96,46.99 180 bottom
R27  76.2,71.12 0 bottom
R28  83.19,64.77 90 bottom
R29  81.28,55.88 90 bottom
R30  76.2,55.88 270 bottom
R31  24.13,66.04 0 bottom
R32  21.59,46.99 90 bottom
R33  54.61,96.52 0 top
R34  64.77,95.25 90 top
R35  54.61,92.71 0 top
R36  58.42,68.58 0 top
R37  7.62,86.36 180 bottom
R38  5.08,76.2 180 bottom
R39  46.99,88.9 90 bottom
R40  46.99,74.93 90 bottom
R41  12.7,83.82 90 bottom
R42  13.97,71.12 90 bottom
R43  34.92,81.28 90 bottom
R44  35.56,71.12 90 bottom
R45  24.13,58.42 0 bottom
R46  24.77,29.84 90 bottom
R47  3.17,36.2 90 bottom
R48  3.17,22.86 90 bottom
R49  3.17,10.16 90 bottom
R50  46.99,36.2 90 bottom
R51  46.99,22.86 90 bottom
R52  46.99,10.16 90 bottom
R53  20.32,31.75 90 bottom
R54  12.7,19.05 90 bottom
R55  17.78,10.16 90 bottom
R56  29.21,31.75 90 bottom
R57  36.83,19.05 90 bottom
R58  32.38,10.16 90 bottom
U1  73.66,20.32 0 bottom

### Tracks (layer width: path | path; a pad name or v marks a point on that pad's centre or on a via)
+5V  (via drill 0.35)
  Top 0.508: v72.39,40.64 74.8,43.05 C25.1
  Top 0.813: R3.1 91.59,11.58 OK1.8 | U1.20 69.85,20.45 C1.1 71.25,19.05 72.39,19.05 U1.7 76.05,15.39 R1.2 | v96.52,17.78 97.84,19.1 97.84,34.29 | 97.84,34.29 97.84,43.13 97.79,43.18 v97.79,44.45 97.79,45.52 94.28,49.02 94.28,50.03 95.25,51 95.25,68.58 | v72.39,30.48 73.66,31.75 73.66,39.37 v72.39,40.64 | 92.71,73.66 92.71,74.93 95.5,77.72 C8.+ | C11.1 90.06,43.42 v91.2,43.42 | v91.44,78.74 90.22,78.74 89.29,77.8 87.96,77.8 v85.72,75.56 | C24.1 62.87,77.68 v61.17,75.99 62.31,75.99 C27.1 | v95.25,35.56 96.52,34.29 97.84,34.29
  Top 2.54: IC1.4 92.71,71.12 | 92.71,71.12 92.71,73.66 IC1.2 | 92.71,71.12 90.17,71.12 90.17,68.58 95.25,68.58 95.25,71.12 92.71,71.12
  Bottom 0.813: v96.52,17.78 92.71,13.97 OK1.8 91.44,11.43 84.64,11.43 83.19,12.88 83.19,13.97 82.55,14.61 76.83,14.61 U1.7 | v72.39,30.48 69.85,27.94 U1.20 | IC2.1 v91.2,43.42 92.23,44.45 v97.79,44.45 | v72.39,40.64 71.86,41.17 IC6.1 | v85.72,75.56 85.72,76.74 81.28,81.19 81.28,82.55 | v95.25,35.56 95.25,33.02 JP1.2 | 81.28,82.55 79.96,83.87 69.9,83.87 64.24,78.21 IC5.1 62.87,77.34 62.16,76.63 61.82,76.63 v61.17,75.99 60.33,75.14 IC7.1 | 81.28,82.55 81.28,88.1 JP13.5 | v91.44,78.74 C8.+ 93.85,77.09 C26.1
+12V  (via drill 0.35)
  Top 0.508: v80.64,68.58 82.06,70 v82.06,71.75 | C4.+ 83.82,67.56 C21.1
  Top 0.813: C4.+ 87.63,68.83 88.34,69.55 88.34,72.2 IC1.3 90.41,75.17 v91.44,76.2 | v89.53,90.17 89.53,88.77 C10.1 83.82,83.06 v83.82,80.01
  Bottom 0.508: IC4.4 78.03,66.66 78.03,67.37 79.25,68.58 v80.64,68.58 | v82.06,71.75 84.99,68.83 C4.+
  Bottom 0.813: v89.53,90.17 89.53,89.53 90.17,88.9 IC3.4 | v83.82,80.01 87.43,76.4 87.43,70.48 85.78,68.83 C4.+ | C6.1 97.79,67.94 D1.C 97.15,70.49 93.34,70.49 91.44,72.39 v91.44,76.2
+12V_IN
  Bottom 0.813: D1.A 93.35,65.41 JP3.1 JP3.2
-12V  (via drill 0.35)
  Top 0.508: v76.83,63.5 76.83,61.73 C20.2
  Top 0.813: v90.17,84.45 87.76,82.05 C9.2 | C20.2 v88.85,60.96 | D2.A 90.81,47.63 v92.71,49.53
  Bottom 0.508: IC3.11 v90.17,84.45 | IC4.11 76.91,61.46 76.91,62.17 76.83,62.24 v76.83,63.5
  Bottom 0.813: C7.2 97.79,53.34 | 97.79,53.34 97.79,49.78 C5.- | IC3.11 90.17,66.64 88.85,65.32 v88.85,60.96 88.85,53.39 v92.71,49.53 95.25,52.07 96.52,52.07 97.79,53.34
-12V_IN
  Top 0.813: D2.C JP3.10
  Bottom 0.813: JP3.9 JP3.10
AGND  (via drill 0.35)  (1 unrouted)
  Bottom 0.508: IC6.8 69.85,51.44 | 69.85,51.44 68.58,51.44 67.31,50.16 JP22.2 | IC2.7 88.27,46.35 87.63,45.72 86.36,45.72 85.72,46.35 IC2.5 | IC5.8 v53.98,75.56 | JP22.1 62.57,52.2 C15.2 | 69.85,51.44 69.98,51.56 C17.2 70.11,53.84 C19.2
  Bottom 0.813: C7.1 C6.2 97.66,62.23 JP3.3 | 88.27,46.35 88.9,45.72 v90.81,45.72 91.69,45.72 v92.08,46.1 v92.84,46.86 v93.6,47.62 C5.+ | IC7.8 69.22,75.56 v68.58,76.2 | IC8.8 34.82,87.1 v34.29,87.63 | C8.- 97.54,75.82 C26.2
  pour Top (isolate 0.406): 0,100 0,0 50,0 50,100
  pour Top (isolate 0.406): 50,100 50,0 100,0 100,100
CH_1_ANA_1  (via drill 0.35)
  Top 0.508: U1.12 59.69,19.05 57.15,19.05 54.61,21.59 54.61,27.94 v55.88,29.21 | v55.73,42.55 R19.2
  Bottom 0.508: v55.88,29.21 55.27,29.82 55.27,41.6 55.73,42.06 v55.73,42.55 55.27,43.01 55.27,56.54 57.73,59 64.73,59 66.66,60.94 67.63,60.94 68.31,61.62 68.31,64.11 66.31,66.12 58.49,66.12 58.47,66.09 58.37,66.09 57.15,67.31 57.15,69.85 59.69,72.39 62.23,72.39 62.87,73.03 IC7.3
CH_1_ANA_2  (via drill 0.35)
  Top 0.508: v57.15,40.01 57.47,40.32 57.78,40.64 R20.2 | v69.85,72.39 v67.31,72.39
  Bottom 0.508: U1.15 56.52,24.77 56.52,26.2 57.33,27 57.33,29.81 56.59,30.54 56.59,38.48 57.15,39.03 v57.15,40.01 57.81,40.66 57.81,43.45 56.59,44.67 56.59,55.32 58.95,57.68 66.25,57.68 71.78,63.22 71.78,70.12 69.85,72.05 v69.85,72.39 | v67.31,72.39 66.04,72.39 65.41,73.03 IC7.5
CH_1_DIGI_1  (via drill 0.35)
  Top 0.508: v69.46,47.38 69.46,44.84 v69.85,44.45 | U1.28 90.17,25.4 v82.55,33.02
  Bottom 0.508: v69.85,44.45 70.48,45.09 IC6.3 | v82.55,33.02 62.7,33.02 JP17.6 59.02,36.83 62.22,40.03 64.16,40.03 67.26,43.13 67.26,45.17 v69.46,47.38
CH_1_DIGI_2  (via drill 0.35)
  Top 0.508: v83.82,34.29 v88.9,29.21
  Bottom 0.508: IC6.5 70.82,47.62 67.92,44.72 67.92,41.91 67.43,41.42 66.98,41.42 64.93,39.37 63.97,39.37 JP17.5 63.97,34.29 v83.82,34.29 | v88.9,29.21 88.9,25.4 U1.27
CH_1_DIGI_3  (via drill 0.35)
  Top 0.508: v67.31,40.64 67.31,46.99 v69.85,49.53 | U1.26 85.09,27.94 v81.28,31.75 | v66.04,31.75 63.97,33.82 JP17.4
  Bottom 0.508: JP17.4 67.31,40.17 v67.31,40.64 | v69.85,49.53 70.48,50.16 IC6.7 | v81.28,31.75 v66.04,31.75
CH_2_ANA_1  (via drill 0.35)
  Top 0.508: U1.11 60.96,20.32 58.42,20.32 55.88,22.86 v55.88,26.67 | R21.2 v66.04,59.05
  Bottom 0.508: v55.88,26.67 55.88,28.1 56.66,28.89 56.66,29.54 55.93,30.27 55.93,40.69 57.15,41.91 57.15,43.18 55.93,44.4 55.93,55.88 58.4,58.34 65.33,58.34 v66.04,59.05 67.26,60.27 67.9,60.27 71.12,63.49 71.12,69.85 67.94,73.03 IC7.7
CH_2_ANA_2  (via drill 0.35)
  Top 0.508: v71.12,60.96 71.12,63.5 v69.85,64.77
  Bottom 0.508: U1.16 59.69,28.38 57.25,30.82 57.25,38.2 58.42,39.37 58.42,40.34 58.47,40.39 58.47,43.18 | 58.47,43.18 58.47,43.73 57.25,44.95 57.25,54.71 59.56,57.02 66.52,57.02 70.46,60.96 v71.12,60.96 | v69.85,64.77 69.22,65.41 IC7.9 | R22.2 58.47,43.18
CH_2_DIGI_1
  Bottom 0.508: IC6.9 78.65,51.44 80.01,50.08 80.01,48.47 81.99,46.49 81.99,42.47 84.43,40.03 85.83,40.03 87.1,38.76 88.58,38.76 90.51,36.83 JP18.6 90.64,32.22 U1.25
CH_2_DIGI_2
  Bottom 0.508: IC6.11 78.65,48.9 81.28,46.27 81.28,43.06 81.33,43.01 81.33,41.99 83.95,39.37 85.56,39.37 JP18.5 88.1,32.22 U1.24
CH_2_DIGI_3
  Bottom 0.508: IC6.14 79.38,45.09 80.01,44.45 80.01,43.39 80.67,42.73 80.67,41.72 JP18.4 85.56,32.22 U1.23
GATE/TRIG_1  (via drill 0.35)
  Top 0.508: C22.1 53.21,83.31 v55.24,81.28
  Bottom 0.508: U1.13 53.29,22.91 53.29,71.7 55.24,73.66 IC5.7 v55.24,81.28
GATE/TRIG_2  (via drill 0.35)
  Top 0.508: C23.1 53.26,73.66 v52.63,73.03
  Bottom 0.508: U1.14 52.63,21.03 v52.63,73.03 52.63,83.74 53.24,84.35 IC5.9
ICSP_MOSI
  Bottom 0.508: JP1.4 92.71,30.48 92.71,35.56 JP2.1
ICSP_RST
  Top 0.508: U1.1 88.9,17.78 83.97,17.78 83.77,17.58 83.77,16 83.06,15.29 81.48,15.29 R1.1
  Bottom 0.508: U1.1 96.52,22.86 JP1.5
ICSP_SCK
  Bottom 0.508: JP1.3 97.79,30.48 97.79,35.56 JP2.2
MCP4822_A  (via drill 0.35)
  Top 0.508: v88.9,78.74 90.81,80.64 v91.44,80.64
  Bottom 0.508: v88.9,78.74 88.9,67.31 88.04,66.45 88.04,49.12 89.53,47.62 IC2.8 | v91.44,80.64 IC3.10
MCP4822_B
  Bottom 0.508: IC2.6 87.38,47.53 87.38,66.72 88.24,67.58 88.24,76.86 87.63,77.47 87.63,80.01 88.9,81.28 IC3.12
MCP4822_CS  (via drill 0.35)
  Top 0.508: v75.56,37.47 76.2,36.83 v76.2,30.48 | v76.2,21.77 77.47,20.5 U1.6
  Bottom 0.508: v75.56,37.47 75.54,37.49 75.54,50.89 76.46,51.81 76.82,52.17 79.19,52.17 80.67,50.69 80.67,48.87 82.65,46.89 82.65,44.35 83.82,43.18 87.22,43.18 87.73,42.67 87.73,42.29 IC2.2 | v76.2,30.48 v76.2,21.77
MCP4822_MOSI
  Bottom 0.508: IC2.4 85.72,41.27 85.82,41.27 87.16,39.93 92,39.93 JP2.5
MCP4822_SCK
  Bottom 0.508: IC2.3 87.53,41.21 87.53,40.83 87.77,40.59 90.03,40.59 92.61,43.18 95.25,43.18 JP2.6
MIDI_CLK
  Bottom 0.508: U1.4 80.06,19 59.74,19 54.61,24.13 54.61,57.15 57.15,59.69 58.76,59.69 58.78,59.66 63.48,59.66 64.61,60.8 JP15.2 64.61,63.66 63.5,64.77 62.57,64.77 62.55,64.8 59.04,64.8 59.02,64.77 55.88,64.77 55.27,65.38 55.27,70.88 57.23,72.84 57.23,74.93 57.76,75.46 57.9,75.46 59.22,76.78 59.55,76.78 59.79,77.02 59.79,77.67 IC5.3
MIDI_CLK_RST
  Bottom 0.508: U1.5 78.18,18.34 59.47,18.34 53.95,23.86 53.95,58.42 | JP15.3 62.06,61.43 60.96,60.33 59.05,60.33 59.03,60.35 55.88,60.35 53.95,58.42 | 53.95,58.42 53.95,71.43 55.91,73.39 55.91,76.2 56.49,76.78 57.01,76.78 57.78,77.56 IC5.5
MIDI_IN
  Top 0.813: R3.2 87.63,10.01 OK1.6 U1.2
MISO
  Bottom 0.508: U1.18 68.58,20.32 90.17,20.32 95.15,25.3 95.15,28.73 95.15,29.21 95.15,31.01 95.89,31.75 JP1.1
MOSI  (via drill 0.35)
  Top 0.508: v93.98,22.86 v96.52,20.32
  Bottom 0.508: v93.98,22.86 93.64,22.86 90.44,19.66 66.7,19.66 U1.17 | v96.52,20.32 96.52,21.93 98.45,23.86 98.45,39.02 96.98,40.49 96.06,40.49 94.94,39.37 JP2.3
N$1
  Bottom 0.813: JP4.2 21.59,19.09 J1.1
N$2
  Bottom 0.813: LED15.A 3.17,5.84 R49.1
N$3
  Top 0.813: U1.10 67.31,12.57 Q1.1 67.16,10.44 R2.1 67.03,7.75 C3.1
N$4
  Top 0.813: U1.9 69.85,12.57 Q1.2 70,10.44 R2.2 70.13,7.75 C2.1
N$5
  Bottom 0.813: J16.1 17.78,4.53 R55.1
N$6
  Bottom 0.813: J1.3 25,6.9 R4.1
N$7
  Bottom 0.813: R53.2 21.59,34.44 JP19.1
N$8
  Bottom 0.813: J17.1 29.38,30.5 R56.1
N$9
  Bottom 0.813: JP19.6 8.1,37.62 R47.2
N$10
  Bottom 0.813: LED16.A 46.75,34.53 R50.1
N$11
  Bottom 0.813: LED17.A 46.75,21.2 R51.1
N$12
  Bottom 0.813: J18.1 36.7,17.5 R57.1
N$13
  Top 0.508: D3.A 87.63,5.71 OK1.3
  Bottom 0.508: D3.A 81.92,9.69 JP5.1
N$14
  Bottom 0.813: R54.2 14.61,22.38 14.61,33.02 16.51,34.92 JP19.3
N$15
  Bottom 0.813: J19.1 32.25,8.6 R58.1
N$16
  Top 0.508: R6.1 97.4,92.47 R7.1
N$17
  Bottom 0.508: JP5.2 D3.C 84.45,6.35 88.9,6.35 OK1.2
N$18
  Bottom 0.813: R49.2 7.87,16.27 7.87,18.13 13.34,23.6 13.34,33.66 13.97,34.29 JP19.4
N$19
  Top 0.508: R7.3 92.4,96.98 R8.2
N$20
  Top 0.508: R12.1 88.61,95.4 R13.2
N$21
  Top 0.508: R11.1 83.28,94.67 R12.3
N$22
  Bottom 0.813: LED1.A 5.41,92.08 R9.1
N$23  (via drill 0.35)
  Top 0.508: JP7.1 73.52,94.59 79.38,94.59 81.89,92.08 v81.92,92.08
  Bottom 0.508: v81.92,92.08 81.97,92.08 IC3.1 IC3.2
N$24
  Top 0.508: R35.2 56.01,92.69 C22.2 D4.C
  Bottom 0.508: IC5.11 56.52,87 D4.C
N$25
  Bottom 0.813: R14.1 44.05,97.16 46.75,94.46 LED2.A
N$26
  Bottom 0.508: JP7.3 76.67,93.56 77.47,92.76 80.56,92.76 81.28,93.48 81.28,94.81 82.37,95.9 83.39,95.9 84.11,95.18 84.11,92.42 85.09,91.44 91.44,91.44 92.71,90.17 IC3.6 IC3.7
N$27
  Top 0.508: R33.2 D4.A
N$28  (via drill 0.35)
  Top 0.508: R7.2 94.9,93.98 93.34,92.42 93.34,85.72 v93.98,85.09
  Bottom 0.508: v93.98,85.09 92.71,83.82 IC3.9
N$29  (via drill 0.35)
  Top 0.508: v94.61,90.17 96.04,88.75 R6.2
  Bottom 0.508: v94.61,90.17 94.61,89.03 94.69,88.96 94.69,88.35 R5.1 96.19,86.18 89.7,86.18 88.9,86.98 IC3.3 88.9,88.9 88.27,89.53 86.36,89.53 85.11,90.78 84.32,90.78 82.24,92.86 81.59,92.86 80.81,92.08 80.01,92.08 79.72,92.08 74.93,92.08 74.13,92.88 JP7.2
N$30  (via drill 0.35)
  Top 0.813: v31.75,80.01 30.66,81.1 30.66,83.1 27.94,85.81 JP14.4
  Bottom 0.508: JP14.4 27.94,87.63 29.21,86.36 31.75,86.36 34.29,88.9 36.83,88.9 37.47,88.27 IC8.7
  Bottom 0.813: R44.2 34.14,72.54 32.72,73.97 32.72,77.33 31.75,78.29 v31.75,80.01
N$31
  Bottom 0.813: LED12.A 46.99,71.01 R40.1
N$32
  Bottom 0.508: LED11.A 46.99,84.01 R39.1
N$33  (via drill 0.35)
  Top 0.508: v81.28,90.81 78.74,93.34 v78.74,93.55
  Bottom 0.508: v78.74,93.55 82.36,97.17 R12.2 | v81.28,90.81 85.65,86.43 85.65,86.42 86.2,85.88 87.95,85.88 88.42,85.42 88.42,84.77 87.63,83.98 IC3.13
N$34  (via drill 0.35)
  Top 0.508: v38.1,76.2 v41.91,80.01 | JP14.3 v25.4,84.45
  Bottom 0.508: v38.1,76.2 36.83,77.47 36.83,80.8 R43.2 33.17,84.45 v25.4,84.45 | v41.91,80.01 41.91,81.92 41.98,81.99 41.98,83.11 40.01,85.09 IC8.5
N$35
  Bottom 0.813: J11.1 32.45,69.7 R44.1
N$36
  Bottom 0.813: R43.1 32.28,82.5 J10.1
N$37  (via drill 0.35)
  Top 0.508: JP7.4 79.21,95.9 R11.2 82.31,90.08 v82.31,88.66 | v87.63,85.09 88.9,85.09 91.44,87.63 v91.44,90.17
  Bottom 0.508: v87.63,85.09 83.97,85.09 R10.1 83.82,87.16 v82.31,88.66 | IC3.5 v91.44,90.17
N$38  (via drill 0.35)
  Top 0.508: R36.2 59.82,68.6 C23.2 59.82,81.41 v60.33,81.92
  Bottom 0.508: v60.33,81.92 IC5.14 60.33,85.72 62.23,87.63 D5.C
N$39
  Top 0.508: R34.2 62.38,96.67 D5.A
N$40  (via drill 0.35)
  Top 0.813: v17.78,80.01 19.51,81.74 19.51,88.09 JP14.1
  Bottom 0.508: JP14.1 20.32,91.44 22.05,93.17 36.12,93.17 IC8.9
  Bottom 0.813: R42.2 13.97,76.2 v17.78,80.01
N$41
  Top 0.508: R20.1 63.65,41.93 C13.1 62.84,43.69 R24.2
N$42
  Bottom 0.813: R38.1 3.6,76.2 3.25,75.85 LED10.A
N$43
  Bottom 0.813: LED9.A 5.84,86.36 R37.1
N$44  (via drill 0.35)
  Top 0.508: v33.02,89.87 31.94,90.95 v31.94,91.69
  Bottom 0.508: v33.02,89.87 41.79,89.87 42.55,89.11 IC8.3 | v31.94,91.69 25.65,91.69 JP14.2
  Bottom 0.813: JP14.2 21.64,87.68 21.64,87.59 19.29,85.24 R41.2
N$45
  Bottom 0.813: LED7.A 25.55,67.68 R31.1
N$46
  Bottom 0.813: J12.1 25.55,60.95 R45.1
N$47
  Bottom 0.508: JP15.1 64.55,65.46 58.77,65.46 58.74,65.43 56.49,65.43 55.93,65.99 55.93,70.61 57.89,72.57 57.89,74.4 59.61,76.12 60.16,76.12 61.59,77.56 IC5.2
N$48
  Bottom 0.813: J13.1 25,28.19 R46.1
N$49
  Bottom 0.508: JP15.4 55.24,62.87 54.61,63.5 54.61,71.16 56.57,73.11 56.57,75.72 56.97,76.12 57.62,76.12 58.52,77.02 58.52,77.67 IC5.4
N$50
  Bottom 0.813: LED4.A 3.25,47.4 R16.1
N$51
  Bottom 0.813: LED8.A 21.66,45.57 R32.1
N$52
  Bottom 0.813: LED13.A 3.25,34.7 R47.1
N$53
  Bottom 0.813: J14.1 20.15,30.5 R53.1
N$54
  Bottom 0.813: R55.2 20.32,14.12 20.32,24.77 15.88,29.21 15.88,32.38 19.05,35.56 JP19.2
N$55
  Bottom 0.813: J15.1 12.83,17.5 R54.1
N$56  (via drill 0.35)
  Top 0.508: JP9.4 74.93,74.93 76.2,73.66 v80.01,73.66
  Bottom 0.508: R28.1 82.06,63.35 80.01,65.39 IC4.6 80.01,66.81 81.15,67.94 82.55,67.94 80.64,69.85 80.64,70.19 80.62,70.21 80.62,73.05 v80.01,73.66
N$57
  Top 0.508: R19.1 58.57,49.51 C12.1 56.01,52.07 R23.2
N$58
  Bottom 0.813: R48.2 7.77,24.28 11.43,27.94 JP19.5
N$59
  Bottom 0.813: LED3.A 3.17,57.84 R15.1
N$60
  Bottom 0.508: IC4.7 83.09,66.1 R28.2
N$61  (via drill 0.35)
  Top 0.508: v60.33,50.16 62.23,48.26 R24.1
  Bottom 0.508: v60.33,50.16 60.92,50.76 60.92,53.17 61.73,53.98 C17.1 72.95,59.75 72.95,62.17 73.65,62.87 75.42,62.87 76.05,63.5 76.05,63.83 76.51,64.28 77.16,64.28 77.47,64.59 77.94,64.59 78.74,65.39 IC4.5
N$62
  Bottom 0.508: R27.2 73.66,70 IC4.1
N$63
  Top 0.508: R25.2 C14.1 60.81,58.7 R21.1
N$64
  Bottom 0.813: LED5.A 46.75,60.57 R17.1
N$65
  Bottom 0.508: JP11.3 80.01,77.47 81.28,76.2 81.28,70.48 85.09,66.67 85.09,62.98 84.25,62.14 82.11,62.14 81.85,62.41 80.81,62.41 80.57,62.17 80.57,61.46 IC4.9 80.01,58.31 79.97,58.27 79.97,55.77 R29.1
N$66
  Bottom 0.813: LED14.A 3.25,21.36 R48.1
N$67
  Bottom 0.508: IC4.8 R29.2
N$68
  Bottom 0.813: LED18.A 46.99,6.01 R52.1
N$69  (via drill 0.35)
  Top 0.508: C16.1 58.55,52.07 R23.1 59.69,53.19 v59.69,53.98
  Bottom 0.508: v59.69,53.98 60.96,55.24 62.23,55.24 62.87,55.24 65.41,55.24 65.86,55.7 67.42,55.7 72.29,60.58 72.29,62.44 73.38,63.52 74.93,63.52 75.39,63.98 75.39,64.1 76.2,64.91 IC4.3
N$70  (via drill 0.35)
  Top 0.508: R25.1 77.47,55.88 v78.74,57.15 80.01,55.88 C18.1
  Bottom 0.508: v78.74,57.15 IC4.10
N$71
  Bottom 0.508: R22.1 R26.2 62.23,47.14 C15.1
N$72
  Bottom 0.813: LED6.A 46.75,47.23 R18.1
N$73  (via drill 0.35)
  Top 0.508: v76.2,58.79 76.2,60.96 76.01,61.15 76.01,62.03 74.93,63.1 74.93,65.91 77.47,68.44 v77.47,68.58
  Bottom 0.508: IC4.13 74.93,57.23 74.97,57.19 76.09,57.19 R30.1 v76.2,58.79 | v77.47,68.58 78.11,68.58 79.96,70.43 79.96,72.44 78.58,73.83 JP11.4
N$74
  Bottom 0.508: IC3.14 83.91,82.49 R10.2
N$75
  Bottom 0.508: R5.2 95.16,83.67 IC3.8
N$76
  Bottom 0.508: IC4.14 74.22,60.34 74.22,57 76.2,55.03 R30.2
N$77  (via drill 0.35)
  Top 0.508: v76.2,76.2 74.93,77.47 JP9.3
  Bottom 0.508: IC4.2 74.93,68.43 R27.1 76.2,72.54 v76.2,76.2
N$78  (via drill 0.35)
  Top 0.508: v70.07,59.47 71.98,59.47 v73.03,58.42
  Bottom 0.508: R26.1 58.42,48.11 58.42,54.61 60.17,56.36 66.97,56.36 v70.07,59.47 | v73.03,58.42 72.39,57.78 C19.1 74.89,54.14 74.89,53.49 75.13,53.25 77.27,53.25 77.51,53.49 77.51,59.02 77.13,59.39 77,59.39 76.82,59.58 76.2,59.58 IC4.12
N$79
  Bottom 0.813: JP8.1 18.69,96.52 18.32,96.88 13.85,96.88 R9.2
N$80
  Bottom 0.813: JP6.2 25.55,3.81 R4.2
N$81
  Bottom 0.813: JP6.1 28.57,10.43 J1.2
N$82
  Bottom 0.813: J9.1 17.55,69.7 R42.1
N$83
  Bottom 0.813: J8.1 12.8,82.5 R41.1
N$84
  Bottom 0.813: JP8.2 24.13,95.25 22.86,93.98 19.27,93.98 J2.1
N$85
  Bottom 0.508: JP8.3 29.21,93.98 34.29,93.98 35.41,95.1 R14.2
N$86
  Bottom 0.813: J3.1 30.23,95.5 JP8.4
N$87
  Bottom 0.813: R15.2 7.63,68.11 7.63,71.23 17.52,81.12 18.32,81.12 19.76,82.55 JP10.1
N$88  (via drill 0.35)
  Top 0.813: J4.1 20.32,59.07 20.32,72.39 v17.78,74.93
  Bottom 0.813: v17.78,74.93 20.32,77.47 JP10.3
N$89  (via drill 0.35)
  Top 0.508: v41.91,77.47 v40.64,76.2
  Bottom 0.508: v41.91,77.47 44.45,77.47 45.09,78.11 45.09,85.18 43.81,86.45 IC8.2 | v40.64,76.2 38.08,78.77 38.08,82.55 34.27,86.36 32.68,86.36 32.02,85.7 20.9,85.7 19.23,84.04 10.22,84.04 9.35,84.91 9.35,86.06 R37.2
N$90
  Top 0.813: J5.1 21.59,47.34 JP10.4
N$91
  Bottom 0.813: JP12.1 29.79,81.33 29.88,81.33 30.24,80.97 32.15,80.97 32.72,80.41 32.72,79.05 33.68,78.08 33.68,74.93 34.31,74.3 36.3,74.3 38.1,72.49 38.1,68.58 43.03,63.65 R17.2
N$92
  Bottom 0.813: JP12.2 29.79,78.79 29.88,78.79 31.75,76.92 31.75,73.66 30.48,72.39 30.48,67.31 35.56,62.23 35.56,57.15 40.64,52.07 45.24,52.07 R18.2
N$93
  Bottom 0.813: J6.1 32.25,63 29.21,66.04 29.21,71.12 26.04,74.3 26.04,76.83 26.67,77.47 JP12.3
N$94  (via drill 0.35)
  Top 0.813: v27.94,70.48 27.94,74.3 JP12.4
  Bottom 0.813: J7.1 30.48,45.27 30.48,62.23 27.94,64.77 v27.94,70.48
N$95  (via drill 0.35)
  Top 0.508: v66.04,81.92 67.31,83.19 v67.31,86.36
  Bottom 0.508: IC5.6 56.52,79.38 57.15,80.01 64.14,80.01 v66.04,81.92 | v67.31,86.36 71.12,86.36 72.86,88.1 JP13.2
N$96  (via drill 0.35)
  Top 0.508: v58.42,86.36 v63.5,86.36
  Bottom 0.508: IC5.12 57.78,85.72 v58.42,86.36 | v63.5,86.36 66.2,86.36 66.98,87.14 68.56,87.14 JP13.1
N$97
  Bottom 0.508: IC5.15 61.59,83.19 62.23,82.55 65.56,82.55 67.7,84.68 73.72,84.68 JP13.4
N$98  (via drill 0.35)
  Top 0.508: v55.24,86.36 57.15,84.45 v64.77,84.45
  Bottom 0.508: IC5.10 v55.24,86.36 | v64.77,84.45 65.66,85.34 71.84,85.34 JP13.3
N$99
  Bottom 0.813: JP20.1 27.94,34.44 R56.2
N$100
  Bottom 0.813: R45.2 21.59,58.42 JP16.1
N$101
  Bottom 0.813: JP16.2 15.82,64.08 15.82,64.17 17.69,66.04 R31.2
N$102
  Bottom 0.813: R46.2 23.5,32.54 23.5,40.01 19.68,43.81 19.68,51.44 9.53,61.59 JP16.4
N$103
  Bottom 0.813: R32.2 21.59,55.88 17.14,60.33 13.97,60.33 12.06,62.23 JP16.3
N$104
  Bottom 0.813: R50.2 41.43,37.62 JP20.6
N$105
  Bottom 0.813: R58.2 32.38,12.06 30.48,13.97 30.48,25.4 34.29,29.21 34.29,31.75 30.48,35.56 JP20.2
N$106
  Bottom 0.813: R51.2 40.49,24.28 38.1,26.67 JP20.5
N$107
  Bottom 0.813: R57.2 35.56,21.74 35.56,33.02 33.02,35.56 JP20.3
N$108
  Bottom 0.813: R52.2 42.13,16.44 42.13,18.07 36.83,23.38 36.83,34.29 35.56,35.56 JP20.4
N$109
  Bottom 0.508: JP17.1 73.66,38.9 73.66,43.18 73.03,43.81 IC6.2
N$110  (via drill 0.35)
  Top 0.508: v69.85,40.64 73.62,44.41 v73.62,48.22
  Bottom 0.508: JP17.2 69.85,37.63 v69.85,40.64 | IC6.6 72.95,48.9 v73.62,48.22
N$111
  Bottom 0.508: JP18.1 76.2,38.57 76.2,49.53 76.83,50.16 IC6.10
N$112
  Bottom 0.508: JP18.2 80.01,37.3 80.01,42.46 78.65,43.81 IC6.15
N$113  (via drill 0.35)
  Top 0.508: v81.28,39.37 81.28,44.45 v80.01,45.72
  Bottom 0.508: JP18.3 83.02,37.63 v81.28,39.37 | v80.01,45.72 79.43,46.3 79.43,46.85 78.65,47.62 IC6.12
N$114
  Bottom 0.508: JP17.3 68.58,38.9 68.58,44.45 70.48,46.35 IC6.4
N$115
  Bottom 0.813: R16.2 7.63,54.78 7.63,57.07 7.62,57.09 7.62,64.77 8.89,66.04 15.88,66.04 17.14,67.31 19.05,67.31 20.32,68.58 20.32,69.85 16.51,73.66 16.51,76.2 20.32,80.01 JP10.2
N$116  (via drill 0.35)
  Top 0.508: v21.59,91.44 v17.78,91.44
  Bottom 0.508: IC8.10 36.93,92.71 36.93,92.06 36.69,91.82 35.7,91.82 35.01,92.51 22.66,92.51 v21.59,91.44 | v17.78,91.44 15.24,88.9 9.31,88.9 7.62,87.21 7.62,77.32 R38.2
N$117  (via drill 0.35)
  Top 0.508: v44.48,91.47 41.91,88.9 v41.27,88.9
  Bottom 0.508: R39.2 45.62,90.32 v44.48,91.47 | v41.27,88.9 IC8.4
N$118
  Bottom 0.508: R40.2 41.76,76.35 38.73,79.38 IC8.6
N$119
  Bottom 0.508: JP9.1 69.85,82.55 62.92,75.62 62.37,75.62 61.59,74.84 IC7.2
N$120
  Bottom 0.508: IC7.4 64.14,75.56 68.58,80.01 JP9.2
N$121
  Bottom 0.508: JP11.1 77.47,82.55 74.93,80.01 74.93,77.47 73.66,76.2 70.45,76.2 69.18,77.47 67.31,77.47 66.67,76.83 IC7.6
N$122  (via drill 0.35)
  Top 0.508: v68.58,71.12 69.85,71.12 v71.12,72.39
  Bottom 0.508: IC7.10 67.94,70.48 v68.58,71.12 | v71.12,72.39 72.39,72.39 74.93,74.93 74.93,76.24 77.33,78.64 77.37,78.64 78.58,79.84 JP11.2
SCK
  Bottom 0.508: U1.19 70.46,20.98 89.9,20.98 91.93,23.01 91.93,25.25 90.78,26.4 90.78,31.43 92.05,32.7 92.05,36.48 93.52,37.95 95.1,37.95 JP2.4
TOP+5V
  Top 0.813: JP14.5 30.48,91.57 C28.1
  Bottom 0.813: JP14.5 32.38,90.81 43.81,90.81 45.09,89.53 IC8.1

### Text on the board
tPlace: MIDI GND
bPlace: +12V | GND | -12V | CORNVERTER | V1.0 | RED | STRIPE | George Rennie | ©2019 | DAC | V1.0 | CORNVERTER | ICSP | VCC | ©2019 | George Rennie | GND